# EAGLE design Pro_Micro_Micro_OLED (EAGLE 7.6.0)
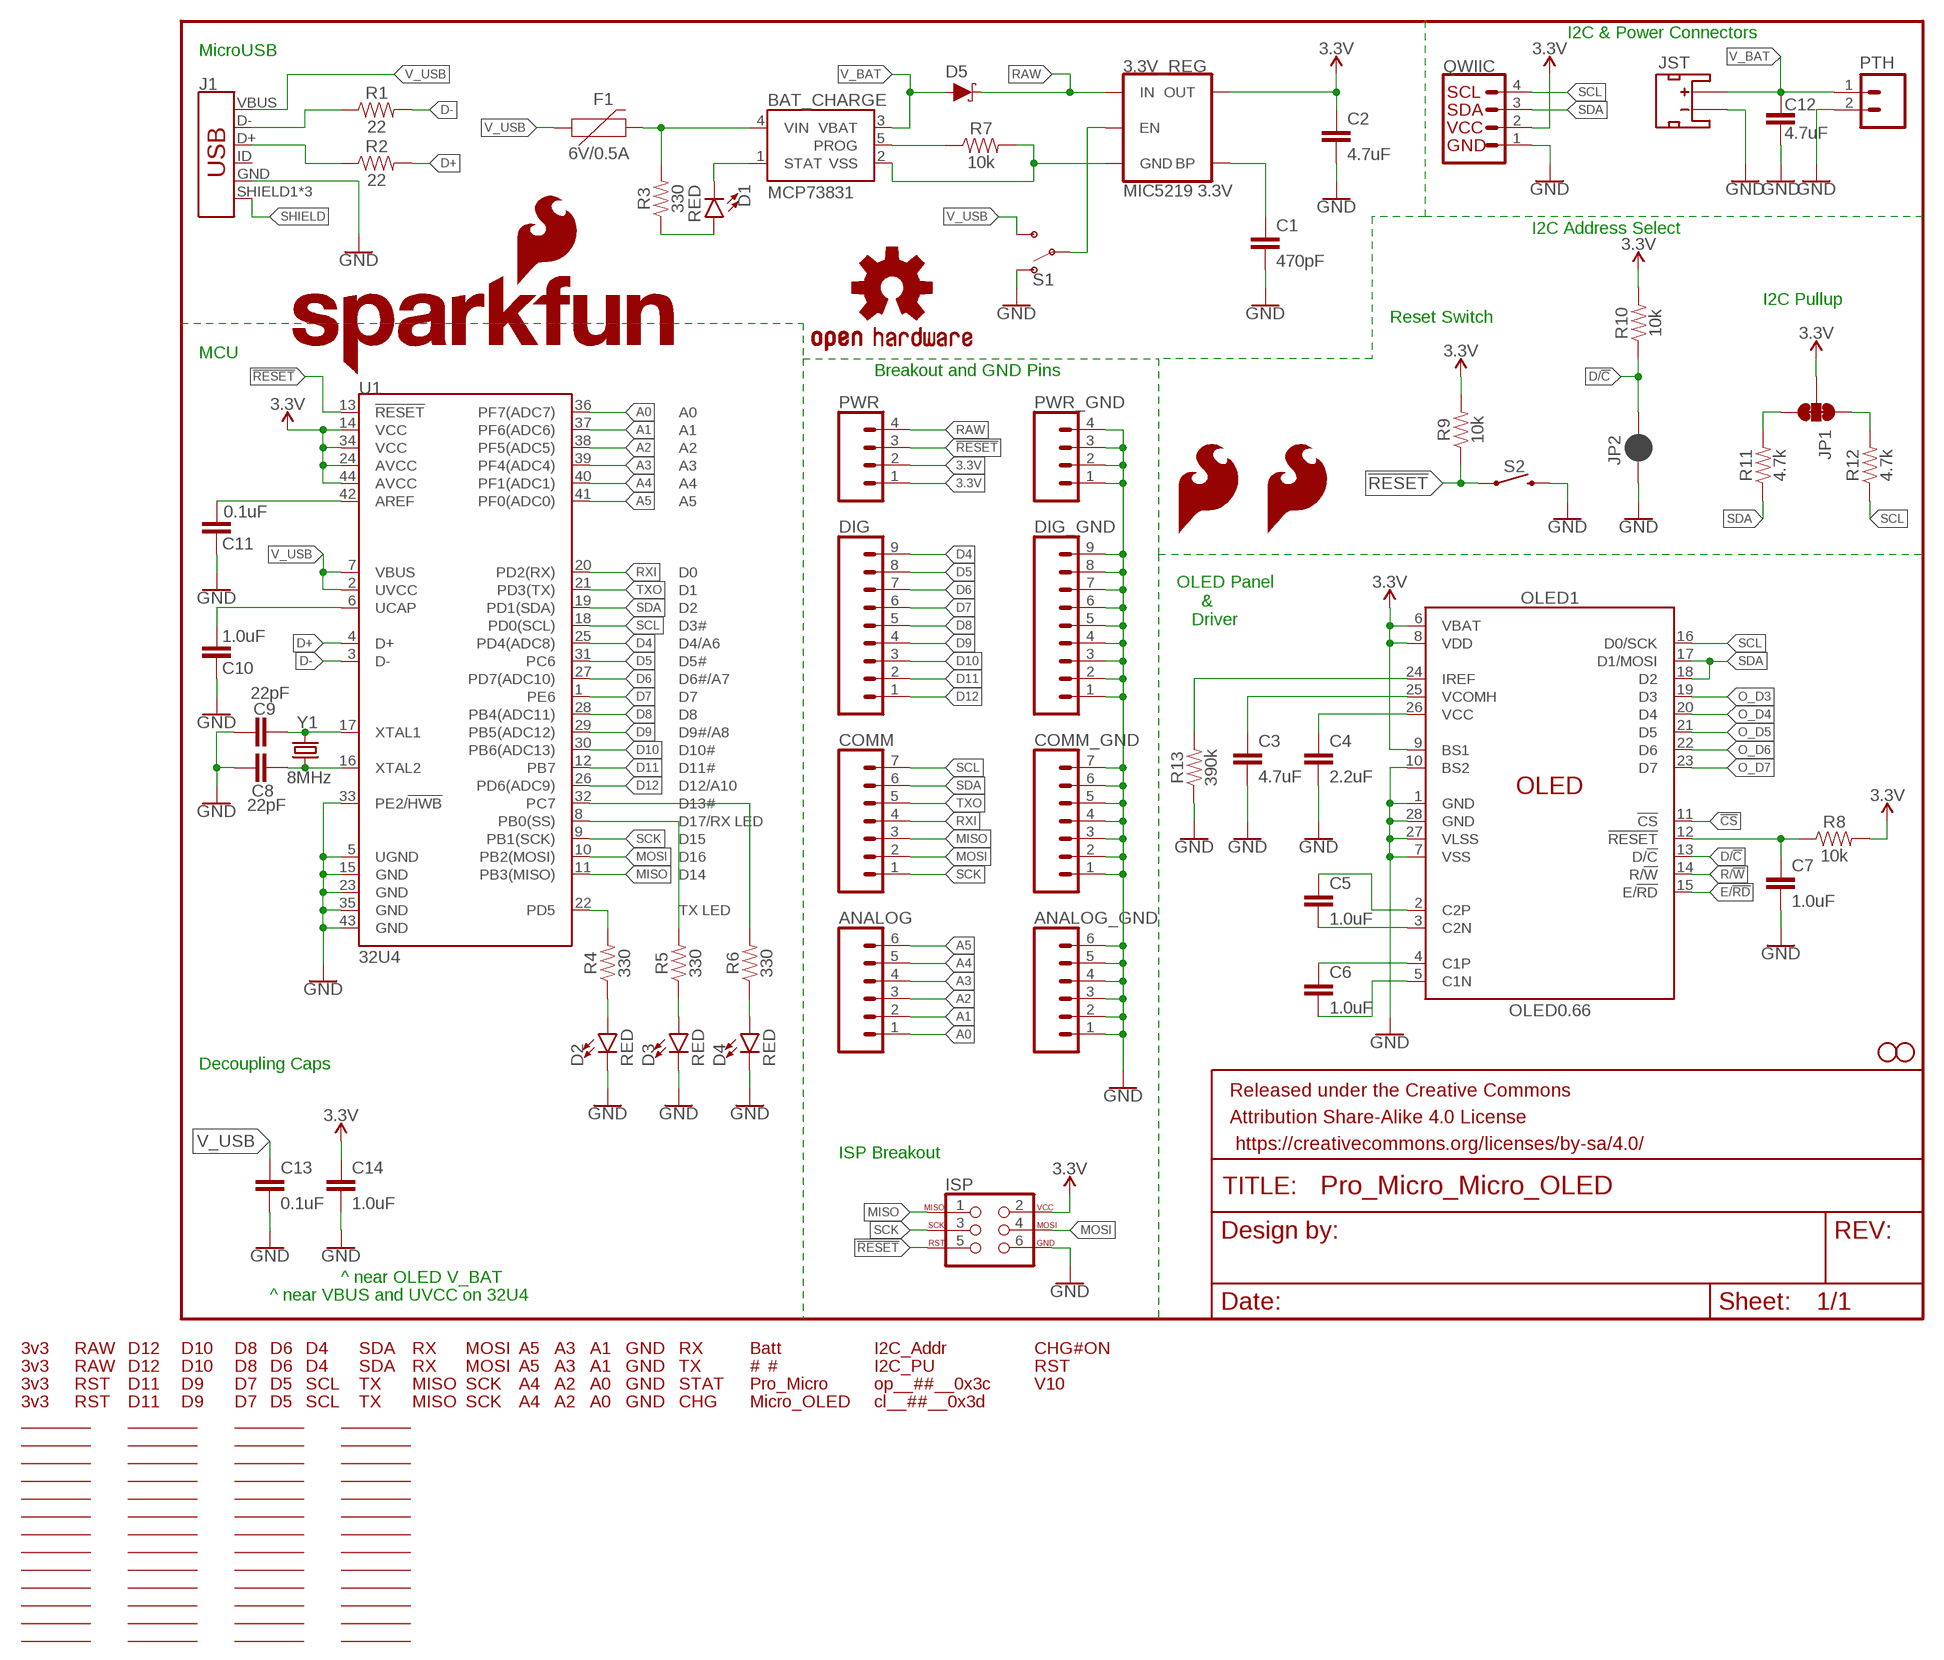
[diagram p0: schematic, sheet 1]

## Parts
3.3V_REG  MIC5219 3.3V  V_REG_MIC52193.3V  [SOT23-5]
ANALOG  CONN_06NO_SILK_FEMALE_PTH  [1X06_NO_SILK]
ANALOG_GND  CONN_06NO_SILK_FEMALE_PTH  [1X06_NO_SILK]
BAT_CHARGE  MCP73831  [SOT23-5]
C1  470pF  470PF-0603-50V-5%  [0603]
C2  4.7uF  4.7UF-1206-16V-(+80/-20%)  [1206]
C3  4.7uF  4.7UF-1206-16V-(+80/-20%)  [1206]
C4  2.2uF  2.2UF-0805-25V-(+80/-20%)  [0805]
C5  1.0uF  1.0UF-0805-25V-10%  [0805]
C6  1.0uF  1.0UF-0805-25V-10%  [0805]
C7  1.0uF  1.0UF-0603-16V-10%  [0603]
C8  22pF  22PF-0603-50V-5%  [0603]
C9  22pF  22PF-0603-50V-5%  [0603]
C10  1.0uF  1.0UF-0603-16V-10%  [0603]
C11  0.1uF  0.1UF-0603-25V-(+80/-20%)  [0603]
C12  4.7uF  4.7UF-1206-16V-(+80/-20%)  [1206]
C13  0.1uF  0.1UF-0603-25V-(+80/-20%)  [0603]
C14  1.0uF  1.0UF-0603-16V-10%  [0603]
COMM  CONN_07NO_SILK  [1X07_NO_SILK]
COMM_GND  CONN_07NO_SILK  [1X07_NO_SILK]
D1  RED  LED-RED0603  [LED-0603]
D2  RED  LED-RED0603  [LED-0603]
D3  RED  LED-RED0603  [LED-0603]
D4  RED  LED-RED0603  [LED-0603]
D5  3A/40V/500mV  DIODE-SCHOTTKY-B340A  [SMA-DIODE]
DIG  CONN_09NO_SILK  [1X09_NO_SILK]
DIG_GND  CONN_09NO_SILK  [1X09_NO_SILK]
F1  6V/0.5A  PPTC_HALF-AMP  [1206]
FRAME1  FRAME-LETTER  [CREATIVE_COMMONS]
H1  STAND-OFF  [STAND-OFF]
H2  STAND-OFF  [STAND-OFF]
ISP  AVR_SPI_PROG_3X2TESTPOINTS  [2X3_TEST_POINTS]
J1  USB_MICRO-BREDUCED_PASTE  [USB-B-MICRO-SMD_RED_PASTE]
JP1  JUMPER-SMT_3_2-NC_TRACE_SILK  [SMT-JUMPER_3_2-NC_TRACE_SILK]
JP2  JUMPER-SMT_2_NC_PASTE_SILK  [SMT-JUMPER_2_NC_PASTE_SILK]
JST  JST_2MM_MALE  [JST-2-SMD]
LOGO1  SFE_LOGO_NAME_FLAME.2_INCH  [SFE_LOGO_NAME_FLAME_.2]
LOGO2  OSHW-LOGOS-COPPER  [OSHW-LOGO-S_COPPER]
LOGO3  SFE_LOGO_FLAME.1COP  [SFE_LOGO_FLAME_COPPER_.1]
LOGO4  SFE_LOGO_FLAME.1_INCH  [SFE_LOGO_FLAME_.1]
OLED1  OLED0.66  [OLED-0.66-64X48]
PTH  CONN_021X02_NO_SILK  [1X02_NO_SILK]
PWR  CONN_041X04_NO_SILK  [1X04_NO_SILK]
PWR_GND  CONN_041X04_NO_SILK  [1X04_NO_SILK]
QWIIC  QWIIC_CONNECTORJS-1MM  [1X04_1MM_RA]
R1  22  22OHM-0603-1/10W-1%  [0603]
R2  22  22OHM-0603-1/10W-1%  [0603]
R3  330  330OHM-0603-1/10W-1%  [0603]
R4  330  330OHM-0603-1/10W-1%  [0603]
R5  330  330OHM-0603-1/10W-1%  [0603]
R6  330  330OHM-0603-1/10W-1%  [0603]
R7  10k  10KOHM-0603-1/10W-1%  [0603]
R8  10k  10KOHM-0603-1/10W-1%  [0603]
R9  10k  10KOHM-0603-1/10W-1%  [0603]
R10  10k  10KOHM-0603-1/10W-1%  [0603]
R11  4.7k  4.7KOHM-0603-1/10W-1%  [0603]
R12  4.7k  4.7KOHM-0603-1/10W-1%  [0603]
R13  390k  390KOHM-0603-1/10W-1%  [0603]
S1  SWITCH-SPDT-SMD-RIGHT-ANGLE  [SWITCH_SPST_SMD_A]
S2  MOMENTARY-SWITCH-SPST-SMD-4.6X2.8MM  [TACTILE_SWITCH_SMD_4.6X2.8MM]
U1  32U4  ATMEGA32U41:1  [QFN-44-NOPAD_1:1]
U$1  3V317  [3V317]
U$2  3V317  [3V317]
U$3  3V317  [3V317]
U$4  3V317  [3V317]
U$5  RAW15  [RAW15]
U$6  RAW15  [RAW15]
U$7  RST16  [RST16]
U$8  RST16  [RST16]
U$9  D120  [D120]
U$10  D120  [D120]
U$11  D111  [D111]
U$12  D111  [D111]
U$13  D102  [D102]
U$14  D102  [D102]
U$15  D93  [D93]
U$16  D93  [D93]
U$17  D84  [D84]
U$18  D84  [D84]
U$19  D75  [D75]
U$20  D75  [D75]
U$21  D66  [D66]
U$22  D66  [D66]
U$23  D57  [D57]
U$24  D57  [D57]
U$25  D48  [D48]
U$26  D48  [D48]
U$27  SCL18  [SCL18]
U$28  SCL18  [SCL18]
U$29  SDA19  [SDA19]
U$30  SDA19  [SDA19]
U$31  TX20  [TX20]
U$32  TX20  [TX20]
U$33  RX21  [RX21]
U$34  RX21  [RX21]
U$35  MISO22  [MISO22]
U$36  MISO22  [MISO22]
U$37  MOSI28  [MOSI28]
U$38  MOSI28  [MOSI28]
U$39  SCK23  [SCK23]
U$40  SCK23  [SCK23]
U$41  A59  [A59]
U$42  A59  [A59]
U$43  A410  [A410]
U$44  A410  [A410]
U$45  A311  [A311]
U$46  A311  [A311]
U$47  A212  [A212]
U$48  A212  [A212]
U$49  A113  [A113]
U$50  A113  [A113]
U$51  A014  [A014]
U$52  A014  [A014]
U$53  GND38  [GND38]
U$54  GND38  [GND38]
U$55  GND39  [GND39]
U$56  GND39  [GND39]
U$57  RX36  [RX36]
U$58  TX34  [TX34]
U$59  STAT35  [STAT35]
U$60  CHG30  [CHG30]
U$61  BATT29  [BATT29]
U$62  #32  [#32]
U$63  #31  [#31]
U$64  PRO_MICRO43  [PRO_MICRO43]
U$65  MICRO_OLED42  [MICRO_OLED42]
U$66  _______39  [_______39]
U$67  _______39  [_______39]
U$68  _______39  [_______39]
U$69  _______39  [_______39]
U$70  _______39  [_______39]
U$71  _______39  [_______39]
U$72  _______39  [_______39]
U$73  _______39  [_______39]
U$74  _______39  [_______39]
U$75  _______39  [_______39]
U$76  _______39  [_______39]
U$77  _______39  [_______39]
U$78  _______39  [_______39]
U$79  _______39  [_______39]
U$80  _______39  [_______39]
U$81  _______39  [_______39]
U$82  _______39  [_______39]
U$83  _______39  [_______39]
U$84  _______39  [_______39]
U$85  _______39  [_______39]
U$86  _______39  [_______39]
U$87  _______39  [_______39]
U$88  _______39  [_______39]
U$89  _______39  [_______39]
U$90  _______39  [_______39]
U$91  _______39  [_______39]
U$92  _______39  [_______39]
U$93  _______39  [_______39]
U$94  _______39  [_______39]
U$95  _______39  [_______39]
U$96  _______39  [_______39]
U$97  _______39  [_______39]
U$98  _______39  [_______39]
U$99  _______39  [_______39]
U$100  _______39  [_______39]
U$101  _______39  [_______39]
U$102  _______39  [_______39]
U$103  _______39  [_______39]
U$104  _______39  [_______39]
U$105  _______39  [_______39]
U$106  _______39  [_______39]
U$107  _______39  [_______39]
U$108  _______39  [_______39]
U$109  _______39  [_______39]
U$110  _______39  [_______39]
U$111  _______39  [_______39]
U$112  _______39  [_______39]
U$113  _______39  [_______39]
U$114  _______39  [_______39]
U$115  _______39  [_______39]
U$116  _______39  [_______39]
U$117  _______39  [_______39]
U$118  I2C_ADDR40  [I2C_ADDR40]
U$119  I2C_PU39  [I2C_PU39]
U$120  OP__##__0X3C42  [OP__##__0X3C42]
U$121  CL__##__0X3D41  [CL__##__0X3D41]
U$122  CHG#ON41  [CHG#ON41]
U$123  RST16  [RST16]
U$124  V1044  [V1044]
Y1  8MHz  CRYSTAL-8MHZSMD-5X3.2  [CRYSTAL-SMD-5X3.2-4PAD]

## Nets
3.3V: 3.3V_REG.5(OUT) C2.1 C14.1 ISP.2 JP1.2 OLED1.6(VBAT) OLED1.8(VDD) OLED1.9(BS1) PWR.1 PWR.2 QWIIC.2 R8.2 R9.2 R10.2 U1.14(VCC) U1.24(AVCC) U1.34(VCC) U1.44(AVCC)
!CS: OLED1.11(!CS!)
!RESET: ISP.5 PWR.3 R9.1 S2.1 S2.2 U1.13(!RESET)
A0: ANALOG.1 U1.36(PF7(ADC7))
A1: ANALOG.2 U1.37(PF6(ADC6))
A2: ANALOG.3 U1.38(PF5(ADC5))
A3: ANALOG.4 U1.39(PF4(ADC4))
A4: ANALOG.5 U1.40(PF1(ADC1))
A5: ANALOG.6 U1.41(PF0(ADC0))
D4: DIG.9 U1.25(PD4(ADC8))
D5: DIG.8 U1.31(PC6)
D6: DIG.7 U1.27(PD7(ADC10))
D7: DIG.6 U1.1(PE6)
D8: DIG.5 U1.28(PB4(ADC11))
D9: DIG.4 U1.29(PB5(ADC12))
D10: DIG.3 U1.30(PB6(ADC13))
D11: DIG.2 U1.12(PB7)
D12: DIG.1 U1.26(PD6(ADC9))
D+: R2.2 U1.4(D+)
D-: R1.2 U1.3(D-)
D/!C: JP2.2 OLED1.13(D/!C!) R10.1
E/!RD: OLED1.15(E/!RD!)
GND: ANALOG_GND.1 ANALOG_GND.2 ANALOG_GND.3 ANALOG_GND.4 ANALOG_GND.5 ANALOG_GND.6 C1.2 C2.2 C3.2 C4.2 C7.2 C8.1 C9.1 C10.2 C11.2 C12.2 C13.2 C14.2 COMM_GND.1 COMM_GND.2 COMM_GND.3 COMM_GND.4 COMM_GND.5 COMM_GND.6 COMM_GND.7 D2.C D3.C D4.C DIG_GND.1 DIG_GND.2 DIG_GND.3 DIG_GND.4 DIG_GND.5 DIG_GND.6 DIG_GND.7 DIG_GND.8 DIG_GND.9 ISP.6 J1.GND JP2.1 JST.1(-) OLED1.1(GND) OLED1.7(VSS) OLED1.10(BS2) OLED1.27(VLSS) OLED1.28(GND) PTH.2 PWR_GND.1 PWR_GND.2 PWR_GND.3 PWR_GND.4 QWIIC.1 R13.1 S1.1(O) S2.3 S2.4 U1.5(UGND) U1.15(GND) U1.23(GND) U1.33(PE2/!HWB) U1.35(GND) U1.43(GND)
MISO: COMM.3 ISP.1 U1.11(PB3(MISO))
MOSI: COMM.2 ISP.4 U1.10(PB2(MOSI))
N$1: J1.D+ R2.1
N$2: BAT_CHARGE.4(VIN) F1.2 R3.2
N$3: D1.A R3.1
N$4: BAT_CHARGE.1(STAT) D1.C
N$5: BAT_CHARGE.5(PROG) R7.1
N$6: 3.3V_REG.4(BP) C1.1
N$7: 3.3V_REG.2(GND) BAT_CHARGE.2(VSS) R7.2
N$8: C9.2 U1.17(XTAL1) Y1.3
N$9: 3.3V_REG.3(EN) S1.2(P)
N$10: J1.D- R1.1
N$11: C11.1 U1.42(AREF)
N$12: C10.1 U1.6(UCAP)
N$13: C7.1 OLED1.12(!RESET!) R8.1
N$14: C8.2 U1.16(XTAL2) Y1.1
N$15: C4.1 OLED1.26(VCC)
N$16: C3.1 OLED1.25(VCOMH)
N$17: R4.2 U1.22(PD5)
N$18: R5.2 U1.8(PB0(SS))
N$19: R6.2 U1.32(PC7)
N$20: D2.A R4.1
N$21: D3.A R5.1
N$22: D4.A R6.1
N$23: OLED1.24(IREF) R13.2
N$24: C5.2 OLED1.3(C2N)
N$25: C5.1 OLED1.2(C2P)
N$26: C6.1 OLED1.4(C1P)
N$27: C6.2 OLED1.5(C1N)
N$28: JP1.1 R12.2
N$29: JP1.3 R11.2
O_D3: OLED1.19(D3)
O_D4: OLED1.20(D4)
O_D5: OLED1.21(D5)
O_D6: OLED1.22(D6)
O_D7: OLED1.23(D7)
R/!W: OLED1.14(R/!W!)
RAW: 3.3V_REG.1(IN) D5.C PWR.4
RXI: COMM.4 U1.20(PD2(RX))
SCK: COMM.1 ISP.3 U1.9(PB1(SCK))
SCL: COMM.7 OLED1.16(D0/SCK) QWIIC.4 R12.1 U1.18(PD0(SCL))
SDA: COMM.6 OLED1.17(D1/MOSI) OLED1.18(D2) QWIIC.3 R11.1 U1.19(PD1(SDA))
SHIELD: J1.SHIELD1(SHIELD) J1.SHIELD2(SHIELD) J1.SHIELD3(SHIELD)
TXO: COMM.5 U1.21(PD3(TX))
V_BAT: BAT_CHARGE.3(VBAT) C12.1 D5.A JST.2(+) PTH.1
V_USB: C13.1 F1.1 J1.VBUS S1.3(S) U1.2(UVCC) U1.7(VBUS)
Unconnected: J1.ID JST.NC1(PAD1) JST.NC2(PAD2)

## Notes on the sheet
- I2C & Power Connectors
- MicroUSB
- I2C Address Select
- I2C Pullup
- Reset Switch
- MCU
- Breakout and GND Pins
- OLED Panel
       &
     Driver
- Decoupling Caps
- ISP Breakout
- ^ near OLED V_BAT
- ^ near VBUS and UVCC on 32U4

## Library data of the parts
3.3V_REG = SparkFun-IC-Power:V_REG_MIC5219: V_REG MIC5219 Standard 3.3V and 5V 500mA LDO voltage regulator in SOT-23 layout. Micrel part MIC5219. BP (by-pass) pin is used to lower output noise with 470pF cap, may be left open.; PROD_ID: VREG-09872
ANALOG ANALOG_GND = SparkFun-Connectors:CONN_06: Multi connection point. Often used as Generic Header-pin footprint for 0.1 inch spaced/style header connections On any of the 0.1 inch spaced packages, you can populate with these: Break Away Headers - Straight <https://www.sparkfun.com/products/116> (PRT-00116) Break Away Male Headers - Right Angle <https://www.sparkfun.com/products/553> (PRT-00553) Female Headers <https://www.sparkfun.com/products/115> (PRT-00115) Break Away Headers - Machine Pin <https://www.sparkfun.com/products/117> (PRT-00117) Break Away Female Headers - Swiss Machine Pin <https://www.sparkfun.com/products/743> (PRT-00743) Arduino Stackable Header - 6 Pin <https://www.sparkfun.com/products/9280> (PRT-09280) For SCREWTERMINALS and SPRING TERMINALS visit here: Screw Terimnals on SparkFun.com <https://www.sparkfun.com/search/results?term=Screw+Terminals> (5mm/3.5mm/2.54mm spacing) This device is also useful as a general connection point to wire up your design to another part of your project. Our various solder wires solder well into these plated through hole pads. Hook-Up Wire - Assortment (Stranded, 22 AWG) <https://www.sparkfun.com/products/11375> (PRT-11375) Hook-Up Wire - Assortment (Solid Core, 22 AWG) <https://www.sparkfun.com/products/11367> (PRT-11367) View the entire wire category on our website here <https://www.sparkfun.com/categories/141>; PROD_ID: CONN-08437
BAT_CHARGE = SparkFun-IC-Power:MCP73831: MCP73831T Li-Ion, Li-Pol Controller Miniature single cell, fully integrated Li-Ion, Li-polymer charge management controller Datasheet <http://ww1.microchip.com/downloads/en/DeviceDoc/20001984g.pdf> SparkFun Products: SparkFun ESP32 Thing <https://www.sparkfun.com/products/13907> SparkFun 9DoF Razor IMU M0 <https://www.sparkfun.com/products/14001>; PROD_ID: IC-09995
C1 = SparkFun-Capacitors:470PF: 470pF ceramic capacitors A capacitor is a passive two-terminal electrical component used to store electrical energy temporarily in an electric field.; PROD_ID: CAP-07884
C2 C3 C12 = SparkFun-Capacitors:4.7UF: 4.7µF ceramic capacitors A capacitor is a passive two-terminal electrical component used to store electrical energy temporarily in an electric field.; PROD_ID: CAP-10300
C4 = SparkFun-Capacitors:2.2UF: 2.2µF ceramic capacitors A capacitor is a passive two-terminal electrical component used to store electrical energy temporarily in an electric field.; PROD_ID: CAP-11624
C5 C6 = SparkFun-Capacitors:1.0UF: 1µF ceramic capacitors A capacitor is a passive two-terminal electrical component used to store electrical energy temporarily in an electric field.; PROD_ID: CAP-08064
C7 C10 C14 = SparkFun-Capacitors:1.0UF: 1µF ceramic capacitors A capacitor is a passive two-terminal electrical component used to store electrical energy temporarily in an electric field.; PROD_ID: CAP-00868
C8 C9 = SparkFun-Capacitors:22PF: 22pF ceramic capacitors A capacitor is a passive two-terminal electrical component used to store electrical energy temporarily in an electric field.; PROD_ID: CAP-07876
C11 C13 = SparkFun-Capacitors:0.1UF: 0.1µF ceramic capacitors A capacitor is a passive two-terminal electrical component used to store electrical energy temporarily in an electric field.; PROD_ID: CAP-00810
COMM COMM_GND = SparkFun-Connectors:CONN_07: Multi connection point. Often used as Generic Header-pin footprint for 0.1 inch spaced/style header connections On any of the 0.1 inch spaced packages, you can populate with these: Break Away Headers - Straight <https://www.sparkfun.com/products/116> (PRT-00116) Break Away Male Headers - Right Angle <https://www.sparkfun.com/products/553> (PRT-00553) Female Headers <https://www.sparkfun.com/products/115> (PRT-00115) Break Away Headers - Machine Pin <https://www.sparkfun.com/products/117> (PRT-00117) Break Away Female Headers - Swiss Machine Pin <https://www.sparkfun.com/products/743> (PRT-00743) For SCREWTERMINALS and SPRING TERMINALS visit here: Screw Terimnals on SparkFun.com <https://www.sparkfun.com/search/results?term=Screw+Terminals> (5mm/3.5mm/2.54mm spacing) This device is also useful as a general connection point to wire up your design to another part of your project. Our various solder wires solder well into these plated through hole pads. Hook-Up Wire - Assortment (Stranded, 22 AWG) <https://www.sparkfun.com/products/11375> (PRT-11375) Hook-Up Wire - Assortment (Solid Core, 22 AWG) <https://www.sparkfun.com/products/11367> (PRT-11367) View the entire wire category on our website here <https://www.sparkfun.com/categories/141> Special notes: Molex polarized connector foot print use with SKU : PRT-08231 with associated crimp pins and housings. 1MM SMD Version SKU: PRT-10208 NOTES ON THE VARIANTS LOCK and LOCK_LONGPADS... This footprint was designed to help hold the alignment of a through-hole component (i.e. 6-pin header) while soldering it into place. You may notice that each hole has been shifted either up or down by 0.005 of an inch from it's more standard position (which is a perfectly straight line). This slight alteration caused the pins (the squares in the middle) to touch the edges of the holes. Because they are alternating, it causes a "brace" to hold the component in place. 0.005 has proven to be the perfect amount of "off-center" position when using our standard breakaway headers. Although looks a little odd when you look at the bare footprint, once you have a header in there, the alteration is very hard to notice. Also,if you push a header all the way into place, it is covered up entirely on the bottom side.
D1-D4 = SparkFun-LED:LED-RED: Red SMD LED Used in manufacturing of most products at SparkFun Packages: 0603 - SMD 0603 package [Product Link] <http://docs.avagotech.com/docs/AV02-0551EN> 0603 SMART - SMD 0603 SMART package ( more efficient and expensive)[Product Link] <http://www.osram-os.com/Graphics/XPic2/00077099_0.pdf> 1206 - SMD1206 package [Product Link] <https://www.sparkfun.com/datasheets/DevTools/LilyPad/Q150OVS4.pdff> SparkFun Products: Pro Mini 328 -5V <https://www.sparkfun.com/products/821> RedBoard <https://www.sparkfun.com/products/12757> IOIO-OTG <https://www.sparkfun.com/products/13613>; PROD_ID: DIO-00819
D5 = SparkFun-DiscreteSemi:DIODE-SCHOTTKY: Schottky diode A Schottky diode is a semiconductor diode which has a low forward voltage drop and a very fast switching action.; PROD_ID: DIO-09886
DIG DIG_GND = SparkFun-Connectors:CONN_09: Multi connection point. Often used as Generic Header-pin footprint for 0.1 inch spaced/style header connections On any of the 0.1 inch spaced packages, you can populate with these: Break Away Headers - Straight <https://www.sparkfun.com/products/116> (PRT-00116) Break Away Male Headers - Right Angle <https://www.sparkfun.com/products/553> (PRT-00553) Female Headers <https://www.sparkfun.com/products/115> (PRT-00115) Break Away Headers - Machine Pin <https://www.sparkfun.com/products/117> (PRT-00117) Break Away Female Headers - Swiss Machine Pin <https://www.sparkfun.com/products/743> (PRT-00743) For SCREWTERMINALS and SPRING TERMINALS visit here: Screw Terimnals on SparkFun.com <https://www.sparkfun.com/search/results?term=Screw+Terminals> (5mm/3.5mm/2.54mm spacing) This device is also useful as a general connection point to wire up your design to another part of your project. Our various solder wires solder well into these plated through hole pads. Hook-Up Wire - Assortment (Stranded, 22 AWG) <https://www.sparkfun.com/products/11375> (PRT-11375) Hook-Up Wire - Assortment (Solid Core, 22 AWG) <https://www.sparkfun.com/products/11367> (PRT-11367) View the entire wire category on our website here <https://www.sparkfun.com/categories/141> Special notes: Molex polarized connector foot print use with SKU : PRT-08231 with associated crimp pins and housings. 1MM SMD Version SKU: PRT-10208 NOTES ON THE VARIANTS LOCK and LOCK_LONGPADS... This footprint was designed to help hold the alignment of a through-hole component (i.e. 6-pin header) while soldering it into place. You may notice that each hole has been shifted either up or down by 0.005 of an inch from it's more standard position (which is a perfectly straight line). This slight alteration caused the pins (the squares in the middle) to touch the edges of the holes. Because they are alternating, it causes a "brace" to hold the component in place. 0.005 has proven to be the perfect amount of "off-center" position when using our standard breakaway headers. Although looks a little odd when you look at the bare footprint, once you have a header in there, the alteration is very hard to notice. Also,if you push a header all the way into place, it is covered up entirely on the bottom side.
F1 = SparkFun-Fuses:PPTC: Resettable Fuse PPTC Resettable Fuse. Really a sort of resistor with a polymeric positive temperature coefficient whose resistance increases dramatically with an increase in temperature. When heated by the power passing through the resistance rises causing the current to be limited, protecting the circuit. This is achieved by the transition of the polymer from a crystalline to an amorphous state where the conductive carbon separates breaking the conductive pathways found in the cool crystalline structure. When a PPTC cools back down it resumes conducting letting the circuit turn back on. SparkFun Products: SparkFun RedBoard - Programmed with Arduino <https://www.sparkfun.com/products/12757> Pro Micro - 5V/16MHz <https://www.sparkfun.com/products/12640> Arduino Pro 328 - 5V/16MHz <https://www.sparkfun.com/products/10915> MP3 Trigger <https://www.sparkfun.com/products/13720>; PROD_ID: RES-08585
FRAME1 = SparkFun-Aesthetics:FRAME-LETTER: Schematic Frame - Letter Standard 8.5x11 US Letter frame
H1 H2 = SparkFun-Hardware:STAND-OFF: Stand Off Drill holes for mechanically mounting via screws, standoffs, etc. Note: Use the keepout ring to avoid running the screw head into surrounding components. Variant Overviews STAND-OFF - Mechanical footprint for a #4 phillips button head screw. STAND-OFF-TIGHT - Mechanical footprint for a #4 phillips button head screw, Example SparkFun Products Screw - Phillips Head (1/4", 4-40, 10 pack) <https://www.sparkfun.com/products/10453> (PRT-10453) Screw - Phillips Head (1/2", 4-40, 10 pack) <https://www.sparkfun.com/products/10452> (PRT-10452) Screw - Phillips Head (3/4", 4-40, 10 pack) <https://www.sparkfun.com/products/10451> (PRT-10451) Screw - Phillips Head (1", 4-40, 10 pack) <https://www.sparkfun.com/products/10450> (PRT-10450)
ISP = SparkFun-Connectors:AVR_SPI_PROG_3X2: AVR ISP 6 Pin This is the reduced ISP connector for AVR programming. Common on Arduino. This footprint will take up less PCB space and can be used with a 10-pin to 6-pin adapter such as SKU: BOB-08508 **Special note about "TEST_POINT" package. The stop mask is on the top side, so if you want your programming test points to be on the bottom of your board, make sure to place this package on the bottom side of the board. This also ensure that the orientation to program from the bottom side will be correct. SparkFun Products: SparkFun ISP Pogo Adapter <https://www.sparkfun.com/products/11591> - NS Tiny AVR Programmer <https://www.sparkfun.com/products/11801> -PTH
J1 = SparkFun-Connectors:USB_MICRO-B: USB Type Micro-B Connector Male/female and PTH/SMT variants SparkFun Products: SparkFun microB USB Breakout <https://www.sparkfun.com/products/12035> SparkFun USB microB Plug Breakout <https://www.sparkfun.com/products/10031> SparkFun ESP8266 Thing <https://www.sparkfun.com/products/13231>; PROD_ID: CONN-11752
JP1 = SparkFun-Jumpers:JUMPER-SMT_3_2-NC_TRACE: Normally closed trace jumper (2 of 2 connections) This jumper has a trace between all three pads so they are normally closed (NC). Use a razor knife to open the connection(s). For best results follow the IPC guidelines for cutting traces: Cutout at least 0.063 mm (0.005 in). Remove all loose material to clean up the cut area. Seal the cut with an approved epoxy. Reapply solder to reclose the connection(s).
JP2 = SparkFun-Jumpers:JUMPER-SMT_2_NC_PASTE: Normally closed solder jumper This jumper has an aperture in the stencil to allow solder paste to bridge the split in the wire so it's normally closed (NC). Wick off the solder to open the connection. Reapply solder to reclose the connection.
JST = SparkFun-Connectors:JST_2MM_MALE: JST 2MM MALE RA CONNECTOR Two pin, compact surface mount connector. Commonly used as a battery input connection point. We really like the solid locking feeling and high current rating on these small connectors. We use these all the time as battery connectors. Mates to single-cell LiPo batteries. Here is the connector we sell at SparkFun: JST Right Angle Connector - White <https://www.sparkfun.com/products/8612> (PRT-08612) Datasheet <http://www.sparkfun.com/datasheets/Prototyping/Connectors/JST-Horizontal.pdf> It was used on these SparkFun products: SparkFun MOSFET Power Controller <https://www.sparkfun.com/products/11214> (PRT-11214) SparkFun Battery Babysitter - LiPo Battery Manager <https://www.sparkfun.com/products/13777> (PRT-13777) And many, many others that required a lipo battery connection.; PROD_ID: CONN-11443; SF_ID: PRT-08612
LOGO1 = SparkFun-Aesthetics:SFE_LOGO_NAME_FLAME: SparkFun Font Logo w/ Flame This is the SparkFun full logo. The logo on the schematic will always be the same size; the package variant is the height of the flame part of the logo. Default layer for the logo on the board is tSilk.
LOGO2 = SparkFun-Aesthetics:OSHW-LOGO: Open-Source Hardware (OSHW) Logo This logo indicates the piece of hardware it is found on incorporates a OSHW license and/or adheres to the definition of open source hardware found here: http://freedomdefined.org/OSHW
LOGO3 LOGO4 = SparkFun-Aesthetics:SFE_LOGO_FLAME: SparkFun Flame Logo This is the SparkFun flame logo. The logo on the schematic will always be the same size; the package variant is the height of the flame. Default layer for the logo on the board is tSilk.
OLED1 = SparkFun-Displays:OLED0.66: Micro OLED TODO: Add description SparkFun Products: Micro OLED Breakout <https://www.sparkfun.com/products/13003>; PROD_ID: LCD-12019
PTH = SparkFun-Connectors:CONN_02: Multi connection point. Often used as Generic Header-pin footprint for 0.1 inch spaced/style header connections On any of the 0.1 inch spaced packages, you can populate with these: Break Away Headers - Straight <https://www.sparkfun.com/products/116> (PRT-00116) Break Away Male Headers - Right Angle <https://www.sparkfun.com/products/553> (PRT-00553) Female Headers <https://www.sparkfun.com/products/115> (PRT-00115) Break Away Headers - Machine Pin <https://www.sparkfun.com/products/117> (PRT-00117) Break Away Female Headers - Swiss Machine Pin <https://www.sparkfun.com/products/743> (PRT-00743) For SCREWTERMINALS and SPRING TERMINALS visit here: Screw Terimnals on SparkFun.com <https://www.sparkfun.com/search/results?term=Screw+Terminals> (5mm/3.5mm/2.54mm spacing) This device is also useful as a general connection point to wire up your design to another part of your project. Our various solder wires solder well into these plated through hole pads. Hook-Up Wire - Assortment (Stranded, 22 AWG) <https://www.sparkfun.com/products/11375> (PRT-11375) Hook-Up Wire - Assortment (Solid Core, 22 AWG) <https://www.sparkfun.com/products/11367> (PRT-11367) View the entire wire category on our website here <https://www.sparkfun.com/categories/141> Special notes: Molex polarized connector foot print use with: PRT-08233 with associated crimp pins and housings. 2.54_SCREWTERM for use with PRT-10571. 3.5mm Screw Terminal footprints for PRT-08084 5mm Screw Terminal footprints for use with PRT-08432
PWR PWR_GND = SparkFun-Connectors:CONN_04: Multi connection point. Often used as Generic Header-pin footprint for 0.1 inch spaced/style header connections On any of the 0.1 inch spaced packages, you can populate with these: Break Away Headers - Straight <https://www.sparkfun.com/products/116> (PRT-00116) Break Away Male Headers - Right Angle <https://www.sparkfun.com/products/553> (PRT-00553) Female Headers <https://www.sparkfun.com/products/115> (PRT-00115) Break Away Headers - Machine Pin <https://www.sparkfun.com/products/117> (PRT-00117) Break Away Female Headers - Swiss Machine Pin <https://www.sparkfun.com/products/743> (PRT-00743) For SCREWTERMINALS and SPRING TERMINALS visit here: Screw Terimnals on SparkFun.com <https://www.sparkfun.com/search/results?term=Screw+Terminals> (5mm/3.5mm/2.54mm spacing) This device is also useful as a general connection point to wire up your design to another part of your project. Our various solder wires solder well into these plated through hole pads. Hook-Up Wire - Assortment (Stranded, 22 AWG) <https://www.sparkfun.com/products/11375> (PRT-11375) Hook-Up Wire - Assortment (Solid Core, 22 AWG) <https://www.sparkfun.com/products/11367> (PRT-11367) View the entire wire category on our website here <https://www.sparkfun.com/categories/141> Special notes: Molex polarized connector foot print use with SKU : PRT-08231 with associated crimp pins and housings. 1MM SMD Version SKU: PRT-10208; PROD_ID: CONN-09696
QWIIC = SparkFun-Connectors:QWIIC_CONNECTOR: SparkFun I2C Standard Qwiic Connector An SMD 1mm pitch JST connector makes it easy and quick (get it? Qwiic?) to connect I2C devices to each other. The Qwiic system <http://www.sparkfun.com/qwiic> enables fast and solderless connection between popular platforms and various sensors and actuators. We carry 200mm <https://www.sparkfun.com/products/14204>, 100mm <https://www.sparkfun.com/products/14205>, 50mm <https://www.sparkfun.com/products/14206>, and breadboard friendly <https://www.sparkfun.com/products/14207> Qwiic cables. We also offer 10 pcs strips <https://www.sparkfun.com/products/14323> the SMD connectors.; PROD_ID: CONN-13694
R1 R2 = SparkFun-Resistors:22OHM: 22Ω resistor A resistor is a passive two-terminal electrical component that implements electrical resistance as a circuit element. Resistors act to reduce current flow, and, at the same time, act to lower voltage levels within circuits. - Wikipedia; PROD_ID: RES-08698
R3-R6 = SparkFun-Resistors:330OHM: 330Ω resistor A resistor is a passive two-terminal electrical component that implements electrical resistance as a circuit element. Resistors act to reduce current flow, and, at the same time, act to lower voltage levels within circuits. - Wikipedia; PROD_ID: RES-00818
R7-R10 = SparkFun-Resistors:10KOHM: 10kΩ resistor A resistor is a passive two-terminal electrical component that implements electrical resistance as a circuit element. Resistors act to reduce current flow, and, at the same time, act to lower voltage levels within circuits. - Wikipedia; PROD_ID: RES-00824
R11 R12 = SparkFun-Resistors:4.7KOHM: 4.7kΩ resistor A resistor is a passive two-terminal electrical component that implements electrical resistance as a circuit element. Resistors act to reduce current flow, and, at the same time, act to lower voltage levels within circuits. - Wikipedia; PROD_ID: RES-07857
R13 = SparkFun-Resistors:390KOHM: 390kΩ resistor A resistor is a passive two-terminal electrical component that implements electrical resistance as a circuit element. Resistors act to reduce current flow, and, at the same time, act to lower voltage levels within circuits. - Wikipedia; PROD_ID: RES-12024
S1 = SparkFun-Switches:SWITCH-SPDT: Single Pole, Double Throw (SPDT) Switch Single-pole, double-throw (SPDT) switch. Variant Overview SMD-AYZ0202 Surface Mount DPDT Switch <https://www.sparkfun.com/products/597> (COM-00597) Used on e.g. LilyPad Arduino USB - ATmega32U4 Board <https://www.sparkfun.com/products/12049> PTH-11.6X4.0MM SPDT Mini Power Switch <https://www.sparkfun.com/products/102> (COM-00102) Used on e.g. SparkFun Simon Says - Through-Hole Soldering Kit <https://www.sparkfun.com/products/10547> (KIT-10547) PTH-11.6X4.0MM-KIT KIT version of SPDT Mini Power Switch - Simplifies soldering by removing tStop of switch pins - only one side can be soldered. PTH-11.6X4.0MM-LOCK LOCK version of SPDT Mini Power Switch - Offset pins hold switch in place for easier soldering. SMD-RIGHT-ANGLE Surface Mount Right Angle Switch <https://www.sparkfun.com/products/10860> (COM-10860) Used on e.g. SparkFun ESP8266 Thing <https://www.sparkfun.com/products/13231>; PROD_ID: SWCH-10651; SF_SKU: COM-10860
S2 = SparkFun-Switches:MOMENTARY-SWITCH-SPST: Momentary Switch (Pushbutton) - SPST Normally-open (NO) SPST momentary switches (buttons, pushbuttons). Variants PTH-12MM - 12mm square, through-hole Momentary Pushbutton Switch - 12mm Square <https://www.sparkfun.com/products/9190> (COM-09190) PTH-6.0MM, PTH-6.0MM-KIT - 6.0mm square, through-hole Mini Pushbutton Switch <https://www.sparkfun.com/products/97> (COM-00097) KIT package intended for soldering kit's - only one side of pads' copper is exposed. PTH-RIGHT-ANGLE-KIT - Right-angle, through-hole Right Angle Tactile Button <https://www.sparkfun.com/products/10791> - Used on SparkFun BigTime Watch Kit <https://www.sparkfun.com/products/11734> SMD-12MM - 12mm square, surface-mount Tactile Button - SMD (12mm) <https://www.sparkfun.com/products/12993> (COM-12993) Used on SparkFun PicoBoard <https://www.sparkfun.com/products/11888> SMD-4.5MM - 4.5mm Square Trackball Switch Used on SparkFun Blackberry Trackballer Breakout <https://www.sparkfun.com/products/13169> SMD-4.6MMX2.8MM - 4.60mm x 2.80mm, surface mount Used on SparkFun SAMD21 Mini Breakout <https://www.sparkfun.com/products/13664> SMD-5.2MM, SMD-5.2-REDUNDANT - 5.2mm square, surface-mount Mini Pushbutton Switch - SMD <https://www.sparkfun.com/products/8720> (COM-08720) Used on Arduino Pro Mini <https://www.sparkfun.com/products/11114> REDUNDANT package connects both switch circuits together SMD-6.0X3.5MM - 6.0 x 3.5mm, surface mount Momentary Reset Switch SMD <https://www.sparkfun.com/products/8229> (COM-08229) SMD-6.2MM-TALL - 6.2mm square, surface mount Tactile Button - SMD (6mm) <https://www.sparkfun.com/products/12992> Used on SparkFun Digital Sandbox <https://www.sparkfun.com/products/12651> SMD-RIGHT-ANGLE - Right-angle, surface mount Used on SparkFun Block for Intel® Edison - Arduino <https://www.sparkfun.com/products/13036>; PROD_ID: SWCH-13065
U1 = SparkFun-IC-Microcontroller:ATMEGA32U4: Atmel MCU, 32KByte Atmel 44-pin 8-bit Microcontroller with 32KBytes of ISP Flash and USB Controller Datasheet <http://cdn.sparkfun.com/datasheets/Dev/Arduino/Boards/ATMega32U4.pdf> SparkFun Products LilyPad Arduino USB - ATmega32U4 Board <https://www.sparkfun.com/products/12049> (DEV-12049) Pro Micro - 5V/16MHz <https://www.sparkfun.com/products/12640> (DEV-12640) Pro Micro - 3.3V/8MHz <https://www.sparkfun.com/products/12587> (DEV-12587) Fio v3 - ATmega32U4 <https://www.sparkfun.com/products/11520> (DEV-11520) Qduino Mini <https://www.sparkfun.com/products/13614> (DEV-13614) Makey Makey - Standard Kit <https://www.sparkfun.com/products/11511> (WIG-11511) Makey Makey Deluxe Kit <https://www.sparkfun.com/products/11519> (WIG-11519); PROD_ID: IC-10828
U$1-U$4 = buzzard_labels:3V317
U$5 U$6 = buzzard_labels:RAW15
U$7 U$8 U$123 = buzzard_labels:RST16
U$9 U$10 = buzzard_labels:D120
U$11 U$12 = buzzard_labels:D111
U$13 U$14 = buzzard_labels:D102
U$15 U$16 = buzzard_labels:D93
U$17 U$18 = buzzard_labels:D84
U$19 U$20 = buzzard_labels:D75
U$21 U$22 = buzzard_labels:D66
U$23 U$24 = buzzard_labels:D57
U$25 U$26 = buzzard_labels:D48
U$27 U$28 = buzzard_labels:SCL18
U$29 U$30 = buzzard_labels:SDA19
U$31 U$32 = buzzard_labels:TX20
U$33 U$34 = buzzard_labels:RX21
U$35 U$36 = buzzard_labels:MISO22
U$37 U$38 = buzzard_labels:MOSI28
U$39 U$40 = buzzard_labels:SCK23
U$41 U$42 = buzzard_labels:A59
U$43 U$44 = buzzard_labels:A410
U$45 U$46 = buzzard_labels:A311
U$47 U$48 = buzzard_labels:A212
U$49 U$50 = buzzard_labels:A113
U$51 U$52 = buzzard_labels:A014
U$53 U$54 = buzzard_labels:GND38
U$55 U$56 = buzzard_labels:GND39
U$57 = buzzard_labels:RX36
U$58 = buzzard_labels:TX34
U$59 = buzzard_labels:STAT35
U$60 = buzzard_labels:CHG30
U$61 = buzzard_labels:BATT29
U$62 = buzzard_labels:#32
U$63 = buzzard_labels:#31
U$64 = buzzard_labels:PRO_MICRO43
U$65 = buzzard_labels:MICRO_OLED42
U$66-U$117 = buzzard_labels:_______39
U$118 = buzzard_labels:I2C_ADDR40
U$119 = buzzard_labels:I2C_PU39
U$120 = buzzard_labels:OP__##__0X3C42
U$121 = buzzard_labels:CL__##__0X3D41
U$122 = buzzard_labels:CHG#ON41
U$124 = buzzard_labels:V1044
Y1 = SparkFun-Clocks:CRYSTAL-8MHZ: 8MHz Crystal Datasheet Example <http://www.futureelectronics.com/en/technologies/electromechanical/timing-devices/crystals/Pages/6008189-ABM3B-8.000MHZ-B2-T.aspx?IM=0> Frequency: 8MHz Frequency Tolerance: ±20ppm Load Capacitance: 18pF SparkFun Products: Pro Micro -3.3V/8MHz <https://www.sparkfun.com/products/12587> WAV Trigger <https://www.sparkfun.com/products/13660>; PROD_ID: XTAL-09431

## Board
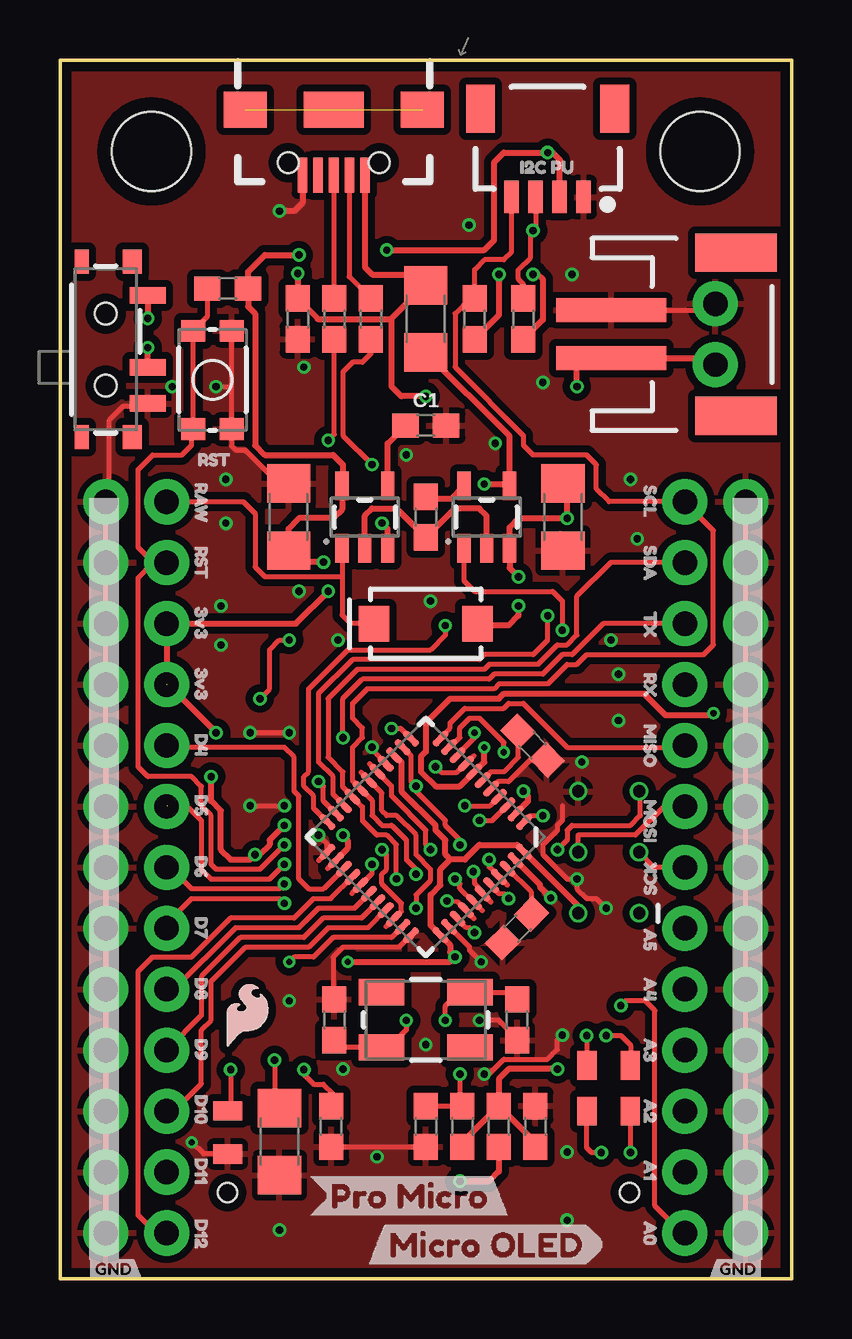
[diagram p1: board, top side]
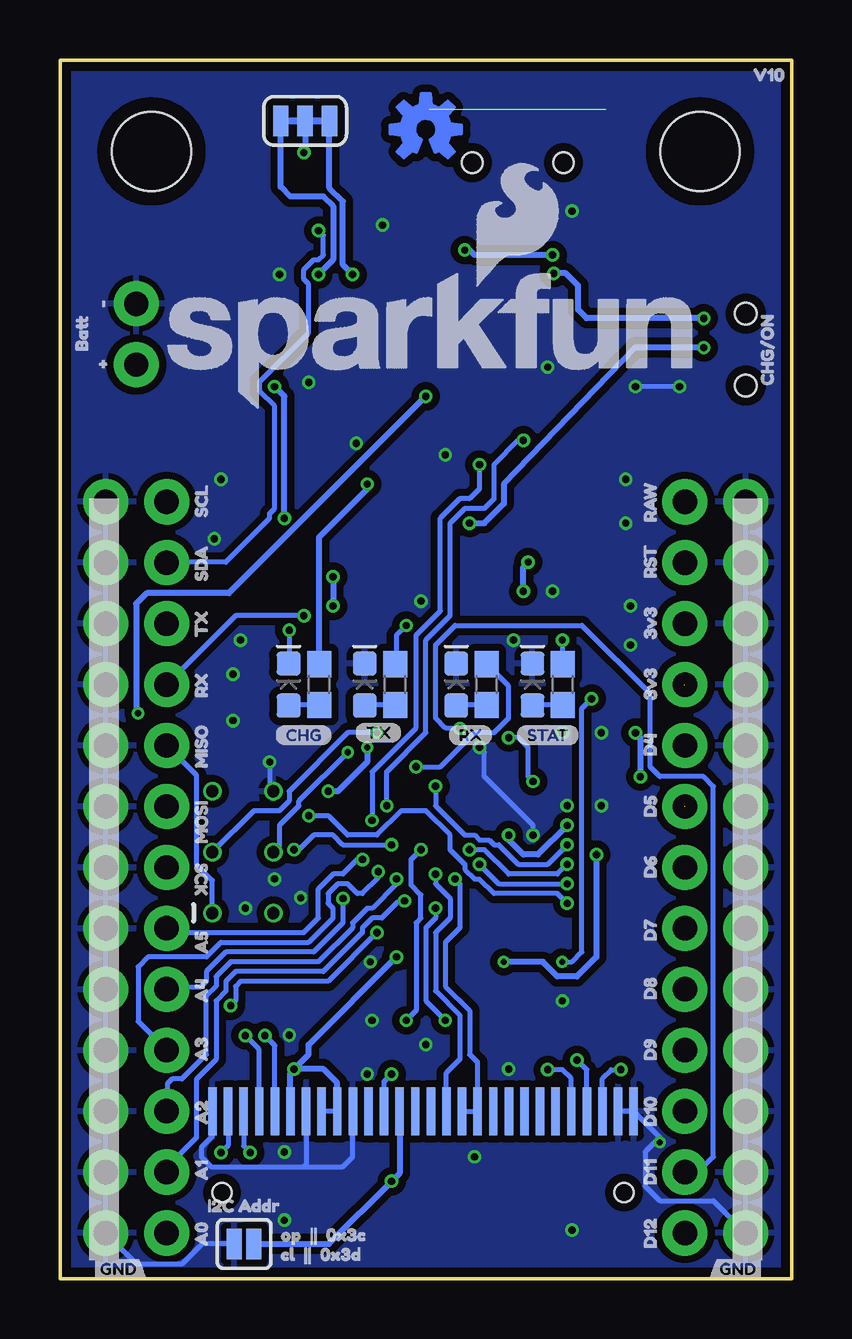
[diagram p2: board, bottom side, seen from below]

Size 30.48 x 50.8 mm. Coordinates in mm from the lower left corner, seen from the top.
Outline: 0,0 30.48,0 30.48,50.8 0,50.8 0,0
Copper layers (1*16): Top 0.035559375mm / dielectric 1.6mm / Bottom 0.035559375mm
Design rules "OSHPARK-2layer": minimum track width 6mil, minimum drill 10mil, track to track 6mil, track to pad 6mil, pad to pad 6mil, via to via 6mil, smd to smd 6mil, copper to edge 15mil, drill to drill 6mil, minimum pad ring 5mil, minimum via ring 5mil, stop-mask expansion 2.5mil, vias tented up to drill 12mil, thermal gap 10mil

### Footprints (pad centres in the part's own frame; a part is rotated, then mirrored left to right if it is on the bottom)
SOT23-5 = smd 0.55 x 1.2: 1 -0.95,-1.3; 2 0,-1.3; 3 0.95,-1.3; 4 0.95,1.3; 5 -0.95,1.3
1X06_NO_SILK = drill 1.016 pad 1.88: 1 0,0; 2 2.54,0; 3 5.08,0; 4 7.62,0; 5 10.16,0; 6 12.7,0
0603 = smd 1.1 x 1: 1 -0.85,0; 2 0.85,0
1206 = smd 1.6 x 1.8: 1 -1.4,0; 2 1.4,0
0805 = smd 0.8 x 1.2: 1 -0.9,0; 2 0.9,0
1X07_NO_SILK = drill 1.016 pad 1.88: 1 0,0; 2 2.54,0; 3 5.08,0; 4 7.62,0; 5 10.16,0; 6 12.7,0; 7 15.24,0
LED-0603 = smd 1 x 1: A -0.877,0; C 0.877,0
SMA-DIODE = smd 1.27 x 1.47: A -2.15,0; C 2.15,0
1X09_NO_SILK = drill 1.016 pad 1.88: 1 0,0; 2 2.54,0; 3 5.08,0; 4 7.62,0; 5 10.16,0; 6 12.7,0; 7 15.24,0; 8 17.78,0; 9 20.32,0
STAND-OFF = hole 3.302: 0,0
2X3_TEST_POINTS = drill 0.508: 1 -2.54,-1.27; 2 -2.54,1.27; 3 0,-1.27; 4 0,1.27; 5 2.54,-1.27; 6 2.54,1.27
USB-B-MICRO-SMD_RED_PASTE = smd 1.45 x 0.4: D+ 2.725,0; D- 2.725,0.65; GND 2.725,-1.3; ID 2.725,-0.65; VBUS 2.725,1.3 | smd 1.5 x 1.8: SHIELD1 0,3.685; SHIELD2 0,-3.685 | smd 1.5 x 2.5: SHIELD3 0,0 | hole 0.85: 2.2,1.9; 2.2,-1.9
SMT-JUMPER_3_2-NC_TRACE_SILK = smd 0.635 x 1.27: 1 -1.016,0; 2 0,0; 3 1.016,0
SMT-JUMPER_2_NC_PASTE_SILK = smd 0.635 x 1.27: 1 -0.406,0; 2 0.406,0
JST-2-SMD = smd 1 x 4.6: 1 -1,-3.7; 2 1,-3.7 | smd 1.6 x 3.4: NC1 -3.4,1.5; NC2 3.4,1.5
OLED-0.66-64X48 = smd 0.35 x 2: 1 0,0; 2 0.65,0; 3 1.3,0; 4 1.95,0; 5 2.6,0; 6 3.25,0; 7 3.9,0; 8 4.55,0; 9 5.2,0; 10 5.85,0; 11 6.5,0; 12 7.15,0; 13 7.8,0; 14 8.45,0; 15 9.1,0; 16 9.75,0; 17 10.4,0; 18 11.05,0; 19 11.7,0; 20 12.35,0; 21 13,0; 22 13.65,0; 23 14.3,0; 24 14.95,0; 25 15.6,0; 26 16.25,0; 27 16.9,0; 28 17.55,0 | hole 0.8: 17.15,-3.4; 0.4,-3.4
1X02_NO_SILK = drill 1.016 pad 1.88: 1 0,0; 2 2.54,0
1X04_NO_SILK = drill 1.016 pad 1.88: 1 0,0; 2 2.54,0; 3 5.08,0; 4 7.62,0
1X04_1MM_RA = smd 0.6 x 1.35: 1 -1.5,0; 2 -0.5,0; 3 0.5,0; 4 1.5,0 | smd 1.2 x 2: NC1 2.8,-3.675; NC2 -2.8,-3.675
SWITCH_SPST_SMD_A = smd 0.7 x 1.5: 1 -2.25,-1.75; 2 -0.75,-1.75; 3 2.25,-1.75 | smd 1 x 0.6: GND1 -3.65,1; GND3 3.65,1 | smd 1 x 0.8: GND2 -3.65,-1.1; GND4 3.65,-1.1 | hole 0.9: -1.5,0; 1.5,0
TACTILE_SWITCH_SMD_4.6X2.8MM = smd 0.9 x 1: 1 -2.05,-0.8; 2 2.05,-0.8; 3 2.05,0.8; 4 -2.05,0.8
QFN-44-NOPAD_1:1 = smd 0.8 x 0.3: 1 -3.337,2.458; 2 -3.337,1.958; 3 -3.337,1.479; 4 -3.337,0.979; 5 -3.337,0.5; 6 -3.337,0; 7 -3.337,-0.5; 8 -3.337,-0.979; 9 -3.337,-1.479; 10 -3.337,-1.958; 11 -3.337,-2.458; 23 3.337,-2.458; 24 3.337,-1.958; 25 3.337,-1.479; 26 3.337,-0.979; 27 3.337,-0.5; 28 3.337,0; 29 3.337,0.5; 30 3.337,0.979; 31 3.337,1.479; 32 3.337,1.958; 33 3.337,2.458 | smd 0.3 x 0.8: 12 -2.458,-3.337; 13 -1.958,-3.337; 14 -1.479,-3.337; 15 -0.979,-3.337; 16 -0.5,-3.337; 17 0,-3.337; 18 0.5,-3.337; 19 0.979,-3.337; 20 1.479,-3.337; 21 1.958,-3.337; 22 2.458,-3.337; 34 2.458,3.337; 35 1.958,3.337; 36 1.479,3.337; 37 0.979,3.337; 38 0.5,3.337; 39 0,3.337; 40 -0.5,3.337; 41 -0.979,3.337; 42 -1.479,3.337; 43 -1.958,3.337; 44 -2.458,3.337
CRYSTAL-SMD-5X3.2-4PAD = smd 1.9 x 1.1: 1 -1.85,-1.15; 2 1.85,-1.15; 3 1.85,1.15; 4 -1.85,1.15

### Placement (x,y rotation side)
3.3V_REG  12.7,31.75 0 top
ANALOG  26.04,1.91 90 top
ANALOG_GND  28.57,1.91 90 top
BAT_CHARGE  17.78,31.75 0 top
C1  15.24,35.56 0 top
C2  9.53,31.75 90 top
C3  9.14,5.71 270 top
C4  6.99,6.1 270 top
C5  22.86,6.99 180 top
C6  22.86,8.89 180 top
C7  15.24,6.35 270 top
C8  19.05,10.79 90 top
C9  11.43,10.79 270 top
C10  19.68,22.23 315 top
C11  19.05,14.61 225 top
C12  20.95,31.75 270 top
C13  9.91,40.01 270 top
C14  19.81,6.35 90 top
COMM  26.04,17.14 90 top
COMM_GND  28.57,17.14 90 top
D1  20.95,24.77 90 bottom
D2  17.78,24.77 90 bottom
D3  13.97,24.77 90 bottom
D4  10.79,24.77 90 bottom
D5  15.24,27.3 180 top
DIG  4.45,1.91 90 top
DIG_GND  1.91,1.91 90 top
F1  15.24,40.01 270 top
FRAME1  24.18,101.14 0 top  (outside the outline)
H1  3.81,46.99 0 top
H2  26.67,46.99 0 top
ISP  22.86,17.78 90 top
J1  11.4,48.72 270 top
JP1  20.27,48.26 180 bottom
JP2  22.81,1.45 0 bottom
JST  26.67,39.37 270 top
LOGO1  26.67,36.2 0 bottom
LOGO2  15.24,47.9 0 bottom
LOGO3  6.65,9.35 0 top
LOGO4  6.65,9.35 0 top
OLED1  24.13,6.99 0 bottom
PTH  27.3,38.1 90 top
PWR  4.45,24.77 90 top
PWR_GND  1.91,24.77 90 top
QWIIC  20.32,45.09 180 top
R1  12.95,40.01 270 top
R2  11.43,40.01 270 top
R3  19.68,24.77 90 bottom
R4  16.51,24.77 90 bottom
R5  12.7,24.77 90 bottom
R6  9.53,24.77 90 bottom
R7  15.24,31.75 270 top
R8  16.76,6.35 270 top
R9  6.99,41.27 0 top
R10  18.29,6.35 90 top
R11  19.3,40.01 270 top
R12  17.27,40.01 270 top
R13  11.3,6.35 90 top
S1  1.91,38.73 90 top
S2  6.35,37.47 270 top
U1  15.24,18.41 225 top
U$1  5.89,28.45 270 top
U$2  5.89,26.21 90 bottom
U$3  5.89,23.67 90 bottom
U$4  5.89,25.91 270 top
U$5  5.89,33.63 270 top
U$6  5.89,31.09 90 bottom
U$7  5.89,30.99 270 top
U$8  5.89,28.75 90 bottom
U$9  5.89,0.81 90 bottom
U$10  5.89,2.95 270 top
U$11  5.89,3.45 90 bottom
U$12  5.89,5.49 270 top
U$13  5.89,5.89 90 bottom
U$14  5.89,8.13 270 top
U$15  5.89,8.64 90 bottom
U$16  5.89,10.46 270 top
U$17  5.89,11.18 90 bottom
U$18  5.89,13 270 top
U$19  5.89,13.61 90 bottom
U$20  5.89,15.54 270 top
U$21  5.89,18.08 270 top
U$22  5.89,16.26 90 bottom
U$23  5.89,18.8 90 bottom
U$24  5.89,20.62 270 top
U$25  5.89,21.34 90 bottom
U$26  5.89,23.16 270 top
U$27  24.59,31.29 90 bottom
U$28  24.59,33.53 270 top
U$29  24.59,28.55 90 bottom
U$30  24.59,31.09 270 top
U$31  24.59,26.31 90 bottom
U$32  24.59,28.24 270 top
U$33  24.59,23.77 90 bottom
U$34  24.59,25.7 270 top
U$35  24.59,20.83 90 bottom
U$36  24.59,23.57 270 top
U$37  24.59,17.68 90 bottom
U$38  24.59,20.42 270 top
U$39  24.59,17.78 270 bottom
U$40  24.59,15.54 90 top
U$41  24.59,13.11 90 bottom
U$42  24.59,15.04 270 top
U$43  24.59,10.97 90 bottom
U$44  24.59,13.11 270 top
U$45  24.59,8.53 90 bottom
U$46  24.59,10.57 270 top
U$47  24.59,5.89 90 bottom
U$48  24.59,8.03 270 top
U$49  24.59,3.66 90 bottom
U$50  24.59,5.38 270 top
U$51  24.59,0.91 90 bottom
U$52  24.59,2.84 270 top
U$53  1.02,0.41 0 top
U$54  29.26,0.41 0 bottom
U$55  3.45,0.41 0 bottom
U$56  27.03,0.41 0 top
U$57  14.33,22.66 0 bottom
U$58  18.19,22.76 0 bottom
U$59  11.48,22.66 0 bottom
U$60  21.54,22.66 0 bottom
U$61  29.57,38.2 90 bottom
U$62  28.75,37.49 90 bottom
U$63  28.55,41.25 270 bottom
U$64  10.36,3.45 0 top
U$65  12.8,1.42 0 top
U$66  1.83,0.41 90 top
U$67  1.83,2.84 90 top
U$68  1.83,5.28 90 top
U$69  1.83,7.72 90 top
U$70  1.83,10.16 90 top
U$71  1.83,12.6 90 top
U$72  1.83,15.04 90 top
U$73  1.83,17.48 90 top
U$74  1.83,19.91 90 top
U$75  1.83,22.35 90 top
U$76  1.83,24.79 90 top
U$77  1.83,27.23 90 top
U$78  1.83,29.67 90 top
U$79  28.65,0.41 90 top
U$80  1.83,30.48 270 bottom
U$81  1.83,32.92 270 bottom
U$82  28.65,30.48 270 bottom
U$83  28.65,23.16 270 bottom
U$84  28.65,32.92 270 bottom
U$85  28.65,25.6 270 bottom
U$86  28.65,28.04 270 bottom
U$87  28.65,15.85 270 bottom
U$88  28.65,13.41 270 bottom
U$89  28.65,10.97 270 bottom
U$90  28.65,18.29 270 bottom
U$91  28.65,20.73 270 bottom
U$92  1.83,28.04 270 bottom
U$93  28.65,6.1 270 bottom
U$94  1.83,25.6 270 bottom
U$95  28.65,8.53 270 bottom
U$96  28.65,3.66 270 bottom
U$97  1.83,23.16 270 bottom
U$98  1.83,20.73 270 bottom
U$99  1.83,18.29 270 bottom
U$100  1.83,15.85 270 bottom
U$101  1.83,13.41 270 bottom
U$102  1.83,10.97 270 bottom
U$103  1.83,8.53 270 bottom
U$104  1.83,6.1 270 bottom
U$105  28.65,15.04 90 top
U$106  28.65,17.48 90 top
U$107  28.65,19.91 90 top
U$108  28.65,22.35 90 top
U$109  28.65,24.79 90 top
U$110  28.65,27.23 90 top
U$111  28.65,29.67 90 top
U$112  1.83,3.66 270 bottom
U$113  28.65,12.6 90 top
U$114  28.65,10.16 90 top
U$115  28.65,7.72 90 top
U$116  28.65,8.53 270 top
U$117  28.65,6.1 270 top
U$118  24.79,3.05 0 bottom
U$119  18.69,46.33 0 top
U$120  21.74,1.83 0 bottom
U$121  21.74,1.02 0 bottom
U$122  1.02,36.78 90 bottom
U$123  5.28,34.14 0 top
U$124  2.03,50.19 0 bottom
Y1  15.24,10.79 180 top

### Tracks (layer width: path | path; a pad name or v marks a point on that pad's centre or on a via)
3.3V  (via drill 0.25, 0.3)  (1 unrouted)
  Top 0.203: R8.2 16.85,5.5 | 16.85,5.5 16.87,5.49 | 11.79,33.09 3.3V_REG.5 | 10.01,29.87 C2.1 | 16.85,5.5 16.85,5.76 | C14.1 19.81,5.68 | U1.14 13.94,21.82 | U1.44 19.34,17.85 | 4.47,24.74 4.52,24.74 | U1.24 11.55,17.44 | 8.33,17.68 v8.13,17.68 | U1.24 | v20.32,46.94 20.52,46.94 | 20.82,46.63 20.83,46.63 | 11.15,17.09 11.35,17.3 11.38,17.3 11.5,17.41 U1.24
  Top 0.254: ISP.2 21.59,15.54 U1.44 19.05,18.09 17.48,18.09 16.87,17.48 16.26,17.48 | C2.1 9.53,31.27 9.96,31.7 11.38,31.7 11.75,32.07 3.3V_REG.5 | v13.61,42.88 17.68,42.88 18.09,43.28 18.09,46.53 18.49,46.94 v20.32,46.94 | 11.79,33.09 11.79,33.93 11.38,34.34 8.53,34.34 8.13,34.75 8.13,40.23 7.83,40.53 R9.2 7.83,41.97 8.53,42.67 v9.96,42.67 | v10.97,29.87 10.01,29.87 | v11.18,28.65 9.83,27.3 PWR.2 PWR.1 | R10.2 18.29,8.33 18.69,8.74 v20.73,8.74 | 16.85,5.76 R10.2 | 19.81,5.68 R10.2 | 13.94,21.82 14.22,21.54 14.22,20.32 15.65,18.9 15.65,18.69 16.05,18.29 16.05,17.68 16.26,17.48 | v9.35,18.9 8.74,18.29 8.74,18.09 8.33,17.68 | v6.3,20.93 6.3,19.91 6.71,19.51 6.71,17.88 7.11,17.48 7.92,17.48 v8.13,17.68 | 4.52,24.74 v6.5,22.76 | 16.26,17.48 15.85,17.07 15.85,16.41 15.44,16 15.44,14.73 U1.34 16.26,13.92 16.26,13.61 v16.46,13.41 16.26,13.21 v11.99,13.21 | v11.79,18.49 11.99,18.29 11.99,17.93 U1.24 | 20.52,46.94 20.83,46.63 | QWIIC.2 20.82,46.63
  Bottom 0.203: OLED1.9 OLED1.8 | 20.27,46.99 v20.32,46.94
  Bottom 0.254: v9.96,42.67 13.21,42.67 13.41,42.88 v13.61,42.88 | v11.18,28.65 11.18,29.67 v10.97,29.87 | OLED1.6 20.88,8.58 v20.73,8.74 | OLED1.9 18.93,8.16 19.51,8.74 v20.73,8.74 | v9.35,18.9 10.57,17.68 11.18,17.68 11.79,18.29 v11.79,18.49 | v6.5,22.76 6.3,22.55 v6.3,20.93 | v20.73,8.74 20.12,9.35 20.12,9.75 v16.46,13.41 | v8.13,17.68 8.13,13.41 8.94,12.6 9.75,12.6 10.36,13.21 v11.99,13.21 | JP1.2 20.27,46.99
!RESET  (via drill 0.3)
  Top 0.203: R9.1 6.13,40.1 S2.1 S2.2 5.49,35.35 5.49,34.75 5.08,34.34 3.86,34.34 3.25,33.73 3.25,30.48 3.89,29.84 | PWR.3 3.89,29.84 | v9.35,18.09 8.33,17.07 6.5,17.07 6.3,17.27 6.3,19.3 5.89,19.71 5.89,20.52 5.49,20.93 3.66,20.93 3.25,21.34 3.25,29.21 3.89,29.84 | ISP.5 24.18,20.27 24.18,19.3 23.77,18.9 21.34,18.9 21.13,18.69 21.13,18.29 v20.73,17.88 | v16.66,18.09 16.66,18.29 16.05,18.9 16.05,19.1 14.83,20.32 v14.83,20.52 14.63,20.73 14.63,21.79 U1.13
  Bottom 0.203: v9.35,18.09 10.16,17.27 11.38,17.27 12.19,18.09 12.39,18.09 12.6,18.29 13.01,18.29 13.21,18.49 13.61,18.49 14.83,19.71 v14.83,20.52 | v16.66,18.09 18.69,18.09 19.1,18.49 19.91,18.49 20.52,17.88 v20.73,17.88
A0  (via drill 0.3)
  Top 0.203: ANALOG.1 25.93,1.91 24.79,3.05 24.79,11.18 24.38,11.58 23.57,11.58 v23.37,11.38 | 16.55,14.94 U1.36 16.93,14.63 17.07,14.63 v17.27,14.43
  Bottom 0.203: v17.27,14.43 19.3,12.39 22.96,12.39 23.16,12.19 23.16,11.58 v23.37,11.38
A1  (via drill 0.3)
  Top 0.203: 17.07,15.21 17.07,15.2 | 17.25,15.01 17.07,15.19 17.07,15.2 | 17.07,15.2 U1.37 16.57,15.7 v16.13,15.75
  Bottom 0.203: ANALOG.2 26.04,4.65 24.79,5.89 24.79,8.33 23.98,9.14 23.98,11.58 23.57,11.99 23.57,12.39 23.16,12.8 19.51,12.8 17.88,14.43 17.88,14.63 17.48,15.04 17.07,15.04 16.41,15.7 v16.13,15.75
A2  (via drill 0.3)
  Top 0.203: v16.46,16.66 16.66,16.46 16.66,16.26 17.22,15.7 U1.38 17.42,15.52 17.6,15.34
  Bottom 0.203: 25.93,6.99 ANALOG.3 26.01,7.01 26.01,8.13 25.81,8.33 25.4,8.33 24.38,9.35 24.38,11.79 23.98,12.19 23.98,12.6 23.37,13.21 19.71,13.21 18.29,14.63 18.29,14.83 17.68,15.44 17.48,15.44 16.46,16.46 v16.46,16.66
A3  (via drill 0.3)
  Top 0.203: 17.75,15.9 17.96,15.7 | 17.75,15.9 | 17.75,15.9 U1.39 17.6,16.13 17.27,16.46 17.27,16.92 v17.22,16.97
  Bottom 0.203: ANALOG.4 27.23,10.72 27.23,13.01 26.82,13.41 24.38,13.41 23.77,14.02 20.12,14.02 19.1,15.04 19.1,15.44 19.3,15.65 19.3,16.05 18.9,16.46 18.49,16.46 18.09,16.05 17.88,16.05 17.22,16.71 v17.22,16.97
A4  (via drill 0.3)
  Top 0.203: U1.40 17.95,16.39 18.29,16.05 18.49,16.05 v18.69,15.85
  Bottom 0.203: ANALOG.5 26.04,12.17 24.61,12.17 24.38,12.39 24.38,12.8 23.57,13.61 19.91,13.61 18.69,14.83 v18.69,15.85
A5  (via drill 0.3)
  Top 0.203: v17.88,17.48 17.88,17.16 U1.41 18.45,16.59 18.47,16.59 18.64,16.41
  Bottom 0.203: 26.01,14.63 ANALOG.6 25.86,14.43 20.32,14.43 19.71,15.04 19.71,16.26 19.1,16.87 18.69,16.87 18.09,17.48 v17.88,17.48
D4
  Top 0.203: U1.25 10.99,16.26 10.36,16.26 9.96,16.66 9.96,20.12 9.75,20.32 9.75,21.74 9.35,22.15 4.52,22.15 DIG.9
D5  (via drill 0.3)  (1 unrouted)
  Top 0.203: 4.47,19.71 5.28,19.71 5.89,19.1 5.89,17.07 6.3,16.66 8.74,16.66 v9.35,17.27 | U1.31 13.99,15.01 | U1.31 14.22,15.31 14.22,15.65 13.41,16.46 13.41,16.87 13.61,17.07 13.61,17.68 v13.41,17.88 | 13.59,14.68 13.74,14.83 13.74,14.86 13.78,14.86 U1.31
  Bottom 0.203: v13.41,17.88 12.8,17.88 11.79,16.87 9.75,16.87 v9.35,17.27
D6  (via drill 0.3)
  Top 0.203: v13.01,17.27 13.01,16.89 U1.27 12.34,16.23 | v9.35,16.46 9.14,16.26 5.49,16.26 4.6,17.14 DIG.7 | 12.37,16.23 12.34,16.23 | 12.34,16.23 12.17,16.05
  Bottom 0.203: v13.01,17.27 12.19,16.46 v9.35,16.46
D7  (via drill 0.3)
  Top 0.203: DIG.6 4.45,14.81 5.49,15.85 9.14,15.85 v9.35,15.65 | U1.1 19.61,19.3 v20.12,19.3
  Bottom 0.203: v9.35,15.65 9.75,16.05 12.39,16.05 13.01,16.66 13.21,16.66 13.61,17.07 13.61,17.27 14.22,17.88 14.22,18.49 15.24,19.51 16.26,19.51 17.27,18.49 18.49,18.49 19.3,19.3 v20.12,19.3
D8
  Top 0.203: U1.28 12.27,15.44 10.77,15.44 9.96,14.63 7.32,14.63 4.75,12.06 DIG.5
D9
  Top 0.203: U1.29 12.57,15.04 10.97,15.04 10.16,14.22 7.52,14.22 5.89,12.6 5.89,10.97 DIG.4
D10
  Top 0.203: DIG.3 4.75,6.99 5.89,8.13 5.89,10.36 6.3,10.77 6.3,12.39 7.72,13.82 10.36,13.82 11.18,14.63 12.84,14.63 U1.30
D11  (via drill 0.3)
  Top 0.203: 14.62,22.57 U1.12 14.2,22.94 v13.82,22.94
  Bottom 0.203: DIG.2 3.89,4.45 3.25,5.08 3.25,20.52 3.66,20.93 5.49,20.93 5.89,21.34 5.89,24.38 8.74,27.23 14.02,27.23 14.83,26.42 14.83,23.37 14.43,22.96 13.84,22.96 v13.82,22.94
D12
  Top 0.203: U1.26 11.29,15.85 10.57,15.85 9.75,15.04 7.11,15.04 5.49,13.41 3.86,13.41 3.25,12.8 3.25,2.64 3.99,1.91 DIG.1
D+  (via drill 0.3)
  Top 0.203: U1.4 17.92,19.71 v16.87,19.71 | v11.18,34.95 11.43,35.2 R2.2
  Bottom 0.203: v11.18,34.95 11.38,34.95 12.39,33.93 12.39,32.51 12.8,32.11 13.61,32.11 14.22,31.5 14.22,27.64 15.24,26.62 15.24,22.76 16.87,21.13 v16.87,19.71
D-  (via drill 0.3)
  Top 0.203: R1.2 12.95,38.56 12.6,38.2 12.19,38.2 11.79,37.8 11.79,35.15 v13.01,33.93 | v17.48,19.1 18.02,19.1 U1.3
  Bottom 0.203: v13.01,33.93 13.01,32.92 13.41,32.51 13.82,32.51 14.63,31.7 14.63,27.84 15.65,26.82 15.65,22.96 17.48,21.13 v17.48,19.1
D/!C  (via drill 0.3)
  Top 0.254: R10.1 18.29,4.47 17.88,4.06 v16.66,4.06
  Bottom 0.254: OLED1.13 16.33,4.4 v16.66,4.06 19.28,1.45 JP2.2
GND  (via drill 0.25, 0.3)
  Top 0.203: 21.18,40.59 21.54,40.23 22.83,40.23 JST.1 27.04,40.37 PTH.2 | C2.2 9.15,33.53 8.74,33.53 7.72,34.54 7.32,34.54 7.15,34.71 S2.3 7.15,37.19 | DIG_GND.1 DIG_GND.2 DIG_GND.3 DIG_GND.4 DIG_GND.5 DIG_GND.6 DIG_GND.7 DIG_GND.8 DIG_GND.9 PWR_GND.1 PWR_GND.2 PWR_GND.3 PWR_GND.4 2.03,32.51 2.03,35.76 2.64,36.37 3.54,36.37 S1.1 4.18,36.48 4.18,36.69 | ANALOG_GND.1 ANALOG_GND.2 ANALOG_GND.3 ANALOG_GND.4 ANALOG_GND.5 ANALOG_GND.6 COMM_GND.1 COMM_GND.2 COMM_GND.3 COMM_GND.4 COMM_GND.5 COMM_GND.6 COMM_GND.7 | 7.15,37.19 S2.4 | U1.35 | U1.35 17.07,13.82 17.07,13.69 v17.55,13.21 | 18.26,13.82 C11.2 | C9.1 11.38,11.7 11.38,13.41 11.79,13.82 14.12,13.82 U1.33 | 21.66,21.62 v21.74,21.54 | R13.1 C7.2 | C4.2 5.98,5.2 v5.49,5.69 | U1.23 11.09,17.79 | v13.01,22.15 13.01,22.04 U1.15 | v6.5,37.19 7.15,37.19 | U1.23 11.14,18.12 v10.77,18.49 | C10.2 19.59,21.62 18.69,20.73 18.26,20.73 U1.5 | C8.1 19.05,10.01 18.29,10.77 v17.48,10.77 | U1.43 18.98,17.39 | 20.93,19.71 20.93,19.1 20.73,18.9 20.73,18.69 20.12,18.09 20.12,17.68 21.13,16.66 v21.54,16.66 21.54,16.26 21.95,15.85 22.35,15.85 v22.76,15.44 | v7.92,22.76 v9.55,22.76 | v20.93,10.16 20.73,9.96 20.73,9.55 20.32,9.14 18.49,9.14 17.88,8.53 v17.68,8.53 | v7.92,19.71 v9.35,19.71 | 10.77,17.42 11,17.65 11.02,17.65 11.02,17.67 U1.23
  Top 0.254: J1.GND 10.11,44.85 9.75,44.5 v9.14,44.5 | 18.98,17.39 19.03,17.39 19.99,16.43 19.99,16.33 v20.45,15.88
  Bottom 0.203: JP2.1 24.56,1.45 25.4,0.61 27.28,0.61 ANALOG_GND.1 | v21.74,21.54 21.74,20.47 ISP.6 | v5.49,5.69 5.49,5.89 | 5.49,5.89 OLED1.28 OLED1.27 | 5.49,5.89 6.1,5.28 6.1,3.86 5.49,3.25 3.25,3.25 DIG_GND.1 | OLED1.1 24.13,5.94 24.59,5.49 24.59,5.08 24.18,4.67 20.32,4.67 | 20.32,4.67 18.69,4.67 18.29,5.08 18.29,6.98 OLED1.10 | OLED1.7 20.23,4.76 20.32,4.67 | v13.01,22.15 12.8,21.95 12.8,20.93 10.77,18.9 v10.77,18.49 | v4.67,37.19 v6.5,37.19
  other vias: 6.71,26.42 6.71,28.04 14.43,34.34 18.14,34.82 10.16,38 15.44,28.24 9.96,28.65 9.55,11.58 11.58,26.62 24.05,30.84 23.77,33.32 9.14,2.03 6.91,33.32 6.91,31.5 13.21,5.08 21.13,5.28 21.34,41.86 15.24,9.75 11.79,8.74 21.13,2.44 23.27,23.27 17.04,43.92 20.12,37.36 23.27,25.2 22.96,26.62
  pour Top (isolate 0.305): 0,0 30.48,0 30.48,8.94 30.48,50.8 0,50.8
  pour Bottom (isolate 0.305): 0.2,0 30.48,0 30.48,50.8 0,50.8 0,0
MISO
  Top 0.203: U1.11 15.86,22.57 15.91,22.57 15.91,22.62 16.26,22.96 16.26,23.16 16.87,23.77 18.49,23.77 18.69,23.98 19.3,23.98 21.13,22.15 25.96,22.15 COMM.3
  Bottom 0.203: ISP.1 24.13,16.61 24.79,17.27 24.79,20.98 COMM.3
MOSI  (via drill 0.25)
  Top 0.203: ISP.4 21.59,18.49 23.98,18.49 25.17,19.68 COMM.2 | U1.10 16.27,22.16 16.66,22.55 16.66,22.96 17.07,23.37 17.48,23.37 18.49,22.35 v18.49,21.95
  Bottom 0.203: ISP.4 21.34,18.03 21.34,18.9 20.52,19.71 20.52,19.91 v18.49,21.95
N$1
  Top 0.203: 11.4,40.89 R2.1 11.4,40.88 J1.D+
N$2  (via drill 0.3)
  Top 0.203: 18.66,33.12 BAT_CHARGE.4
  Top 0.254: BAT_CHARGE.4 18.73,35.12 F1.2 | v17.68,33.12 18.66,33.12
  Bottom 0.254: R3.2 19.68,30.91 17.68,32.92 v17.68,33.12
N$3
  Bottom 0.203: R3.1 20.93,23.91 D1.A
N$4  (via drill 0.3)
  Top 0.203: BAT_CHARGE.1 16.83,29.09 17.27,28.65 20.52,28.65 20.93,28.25 v20.93,27.03
  Bottom 0.203: v20.93,27.03 20.93,25.67 D1.C
N$5
  Top 0.203: R7.1 15.24,32.51
  Top 0.254: 15.24,32.51 16.29,32.51 BAT_CHARGE.5
N$6
  Top 0.254: 3.3V_REG.4 13.65,34.82 C1.1
N$7
  Top 0.254: 3.3V_REG.2 12.7,31.8 13.01,32.11 14.03,32.11 R7.2 16.45,32.11 17.48,32.11 17.78,31.8 BAT_CHARGE.2
N$8  (via drill 0.3)
  Top 0.203: C9.2 11.73,9.64 Y1.3 13.7,9.96 14.02,9.96 14.43,10.36 v14.43,10.77 | v14.83,15.44 14.83,16 15.44,16.61 15.44,17.07 14.83,17.68 14.83,18.49 14.02,19.3 13.61,19.3 13.41,19.51 13.41,20.24 U1.17 12.8,20.85 12.8,20.88 12.78,20.88 12.55,21.11
  Bottom 0.203: v14.43,10.77 15.24,11.58 15.24,14.63 14.83,15.04 v14.83,15.44
N$9  (via drill 0.3)
  Top 0.203: 3.67,38 S1.2 | 3.67,38 3.66,38 3.25,38 | 4.27,38 3.67,38
  Top 0.254: 3.3V_REG.3 13.65,31.26 v13.41,31.5 | 3.66,38 v3.66,38.81
  Bottom 0.254: v13.41,31.5 12.8,31.5 11.99,32.31 11.99,33.12 6.5,38.81 v3.66,38.81
N$10
  Top 0.203: R1.1 12.05,41.76 12.05,41.77 J1.D-
N$11
  Top 0.203: C11.1 19.65,16.09 U1.42
N$12
  Top 0.203: U1.6 17.96,21.13 18.49,21.13 19.1,21.74 19.1,22.81 C10.1
N$13  (via drill 0.3)
  Top 0.203: C7.1 R8.1 16.66,7.3 v16.66,8.53
  Bottom 0.203: OLED1.12 16.98,8.22 v16.66,8.53
N$14  (via drill 0.3)
  Top 0.203: C8.2 18.75,11.95 Y1.1 16.93,11.79 16.46,11.79 16.05,11.38 v16.05,10.77 | v15.44,17.88 15.24,18.09 15.24,18.69 13.82,20.12 13.82,20.52 13.23,21.11 U1.16 13.05,21.31 13.03,21.31 13.03,21.34 12.9,21.46
  Top 0.406: 17.09,11.79 Y1.1
  Bottom 0.203: v16.05,10.77 15.65,11.18 15.65,14.83 15.44,15.04 15.44,16 15.85,16.41 15.85,17.48 v15.44,17.88 15.65,17.68
N$15  (via drill 0.3)
  Top 0.203: v7.11,8.71 7.11,7.12 C4.1
  Bottom 0.203: OLED1.26 7.88,8.35 7.52,8.71 v7.11,8.71
N$16  (via drill 0.3)
  Top 0.203: v8.94,9.12 8.94,7.32 C3.1
  Bottom 0.203: OLED1.25 8.53,8.71 v8.94,9.12
N$17  (via drill 0.3)
  Top 0.203: v16.05,27.23 16.05,26.82 15.44,26.21 11.99,26.21 10.36,24.59 10.36,21.13 10.16,20.93 10.16,20.52 10.57,20.12 10.57,19.61 11.04,19.13 U1.22
  Bottom 0.203: R4.2 16.46,25.67 16.46,26.82 v16.05,27.23
N$18  (via drill 0.3)
  Top 0.203: v15.65,21.34 15.88,21.11 16.54,21.11 16.89,21.47 U1.8 17.09,21.65 17.09,21.67 17.12,21.67 17.25,21.79
  Bottom 0.203: R5.2 11.79,24.7 11.79,23.37 12.39,22.76 13.21,22.76 14.63,21.34 v15.65,21.34
N$19  (via drill 0.25, 0.3)
  Top 0.203: U1.32 | U1.32 13.82,14.22 11.38,14.22 10.57,13.41 9.75,13.41 v9.55,13.21 | v8.33,24.18 8.74,24.59 8.74,26.21 9.14,26.62 v9.55,26.62
  Bottom 0.203: v9.55,13.21 9.14,13.21 8.74,13.61 8.74,23.77 v8.33,24.18 | v9.55,26.62 9.55,25.64 R6.2
N$20
  Bottom 0.203: R4.1 17.75,23.91 D2.A
N$21
  Bottom 0.203: R5.1 13.94,23.91 D3.A
N$22
  Bottom 0.203: R6.1 10.77,23.91 D4.A
N$23  (via drill 0.3)
  Top 0.203: v10.16,8.71 10.16,8.51 10.57,8.1 10.97,8.1 11.38,7.7 11.38,7.28 R13.2
  Bottom 0.203: OLED1.24 9.18,8.34 9.55,8.71 v10.16,8.71
N$24  (via drill 0.3)
  Top 0.203: v22.55,5.26 22.15,5.26 21.95,5.46 21.95,6.97 C5.2
  Bottom 0.203: OLED1.3 22.83,5.53 v22.55,5.26
N$25  (via drill 0.3)
  Top 0.203: v23.77,5.26 23.77,6.97 C5.1
  Bottom 0.203: OLED1.2 23.48,5.55 v23.77,5.26
N$26  (via drill 0.3)
  Top 0.203: v22.76,10.13 23.37,10.13 23.77,9.73 23.77,8.9 C6.1
  Bottom 0.203: OLED1.4 22.18,9.56 v22.76,10.13
N$27  (via drill 0.3)
  Top 0.203: v21.95,10.13 21.95,8.9 C6.2
  Bottom 0.203: OLED1.5 21.53,9.72 v21.95,10.13
N$28  (via drill 0.3)
  Top 0.254: v18.29,41.86 18.29,40.17 R12.2
  Bottom 0.254: v18.29,41.86 18.69,42.27 18.69,44.91 19.25,45.47 JP1.1
N$29  (via drill 0.3)
  Top 0.254: v19.71,41.86 19.91,41.86 20.12,41.66 20.12,39.97 R11.2
  Bottom 0.254: v19.71,41.86 19.1,42.47 19.1,44.7 19.51,45.11 20.88,45.11 21.29,45.52 JP1.3
RAW
  Top 0.203: D5.C 12.12,27.3 11.75,27.67 11.75,29.26 | 3.3V_REG.1 11.75,29.26 | 11.75,29.26 8.53,29.26 8.13,29.67 8.13,31.9 7.64,32.38 PWR.4
RXI  (via drill 0.3)
  Top 0.203: U1.20 11.77,19.73 11.77,19.8 11.38,20.19 11.38,20.93 10.77,21.54 10.77,24.38 12.19,25.81 17.48,25.81 17.68,26.01 19.71,26.01 20.32,26.62 v20.32,27.64
  Bottom 0.203: v20.32,27.64 23.16,27.64 COMM.4
SCK  (via drill 0.25)
  Top 0.203: COMM.1 24.77,17.14 ISP.3 | U1.9 16.55,21.84 17.27,22.55 v17.27,22.76
  Bottom 0.203: ISP.3 22.4,19.51 21.34,19.51 20.93,19.91 20.93,20.32 18.49,22.76 v17.27,22.76
SCL  (via drill 0.3)
  Top 0.203: U1.18 12.5,20.42 12.5,20.45 12.19,20.75 12.19,22.15 12.6,22.55 12.6,22.96 12.19,23.37 12.19,23.98 12.8,24.59 18.09,24.59 18.29,24.79 20.32,24.79 21.13,25.6 21.54,25.6 21.95,26.01 26.82,26.01 27.23,26.42 27.23,31.19 COMM.7 22.89,32.38 22.35,32.92 22.35,33.93 21.95,34.34 19.71,34.34 19.3,34.75 19.3,35.15 16.46,38 16.46,40.23 17.08,40.85 R12.1 17.27,42.06 17.68,42.47 18.49,42.47 18.82,42.8 QWIIC.4 | U1.18 12.53,20.39 | v14.83,16.87 14.83,17.07 14.43,17.48 14.43,18.29 13.82,18.9 13.41,18.9 13.01,19.3 13.01,19.94 U1.18
  Bottom 0.203: OLED1.16 14.38,8.58 13.82,9.14 13.82,10.97 14.83,11.99 14.83,14.43 14.22,15.04 14.22,15.85 14.83,16.46 v14.83,16.87
SDA  (via drill 0.3)
  Top 0.203: U1.19 12.19,20.12 12.16,20.12 11.79,20.5 11.79,21.13 11.18,21.74 11.18,24.18 12.39,25.4 17.68,25.4 17.88,25.6 19.91,25.6 20.73,26.42 21.13,26.42 21.54,26.82 21.54,28.45 22.96,29.87 26.01,29.87 | 26.01,29.87 25.98,29.84 COMM.6 26.01,29.87 | R11.1 19.3,41.45 19.1,41.66 19.1,42.06 19.61,42.57 19.61,43.59 v19.71,43.69 19.84,43.81 19.84,45.07 QWIIC.3 | U1.19 12.23,20.08 12.23,20.06 12.25,20.06 | U1.19 12.6,19.67 12.6,19.1 13.21,18.49 13.61,18.49 14.02,18.09 v14.02,16.66
  Bottom 0.203: COMM.6 26.01,29.87 23.57,29.87 21.74,31.7 21.74,31.9 21.54,32.11 21.54,36.37 22.15,36.98 22.15,37.39 20.12,39.42 20.12,41.45 20.32,41.66 20.32,42.06 19.91,42.47 19.71,42.47 19.51,42.67 19.51,43.48 v19.71,43.69 | OLED1.17 OLED1.18 13.08,9.02 13.41,9.35 13.41,11.18 14.43,12.19 14.43,14.02 13.82,14.63 13.82,16.46 v14.02,16.66
SHIELD  (2 unrouted)
TXO  (via drill 0.3)
  Top 0.203: U1.21 | U1.21 10.97,19.91 10.97,20.52 v10.77,20.73 | COMM.5 22.63,27.3 21.34,26.01 20.93,26.01 20.12,25.2 18.09,25.2 17.88,24.99 12.6,24.99 11.79,24.18 v11.79,22.55
  Bottom 0.203: v10.77,20.73 10.97,20.93 10.97,22.15 11.38,22.55 v11.79,22.55
V_BAT  (via drill 0.3)
  Top 0.203: 20.93,33.12 C12.1 21.13,32.97 | 17.52,27.43 D5.A 17.47,27.23 | 21.54,38.2 21.74,38.41 22.93,38.41 JST.2
  Top 0.254: JST.2 27.04,38.37 PTH.1 | v19.1,29.26 18.73,29.63 BAT_CHARGE.3 18.73,31.33 19.1,31.7 v21.13,31.7 21.13,32.97 | v19.1,28.04 19.1,27.64 18.69,27.23 17.47,27.23 | v21.54,37.19 21.54,38.2
  Bottom 0.254: v19.1,29.26 v19.1,28.04 | v21.13,31.7 21.13,36.78 v21.54,37.19
V_USB  (via drill 0.25, 0.3)
  Top 0.203: 15.19,41.41 F1.1 14.83,41.81 14.83,41.86 | 17.25,21.11 U1.7 17.27,21.13 | 12.71,42.17 12.7,42.16 | U1.2
  Top 0.254: 15.19,41.41 13.82,40.03 | 12.7,42.16 13.01,41.86 14.83,41.86 | U1.2 19.51,19.91 19.51,20.12 v19.3,20.32 | 17.25,21.11 16.66,20.52 15.65,20.52 15.04,21.13 15.04,21.77 15.24,21.97 15.24,23.16 16.26,24.18 18.29,24.18 18.49,24.38 24.38,24.38 24.38,24.33 25.22,23.5 27.15,23.5 v27.23,23.57 | 17.27,21.13 17.68,21.54 v17.68,22.15 | v15.24,36.78 14.22,36.78 13.82,37.19 13.82,40.03 | J1.VBUS 12.71,42.17 | 13.82,40.03 13.79,40.01 10.74,40.01 10.73,40.02 10.73,40.03 C13.1 v9.91,41.91 | S1.3 v3.66,40.03
  Top 0.406: S1.3
  Bottom 0.254: v15.24,36.78 23.44,28.57 26.87,28.57 27.3,28.14 27.3,23.65 v27.23,23.57 | v17.68,22.15 17.68,21.54 18.9,20.32 v19.3,20.32 | v9.91,41.91 9.4,41.91 8.89,41.4 8.89,40.39 8.53,40.03 v3.66,40.03